# Altium project OpenRex_V1I1.PrjPcb (part 1 of 13)
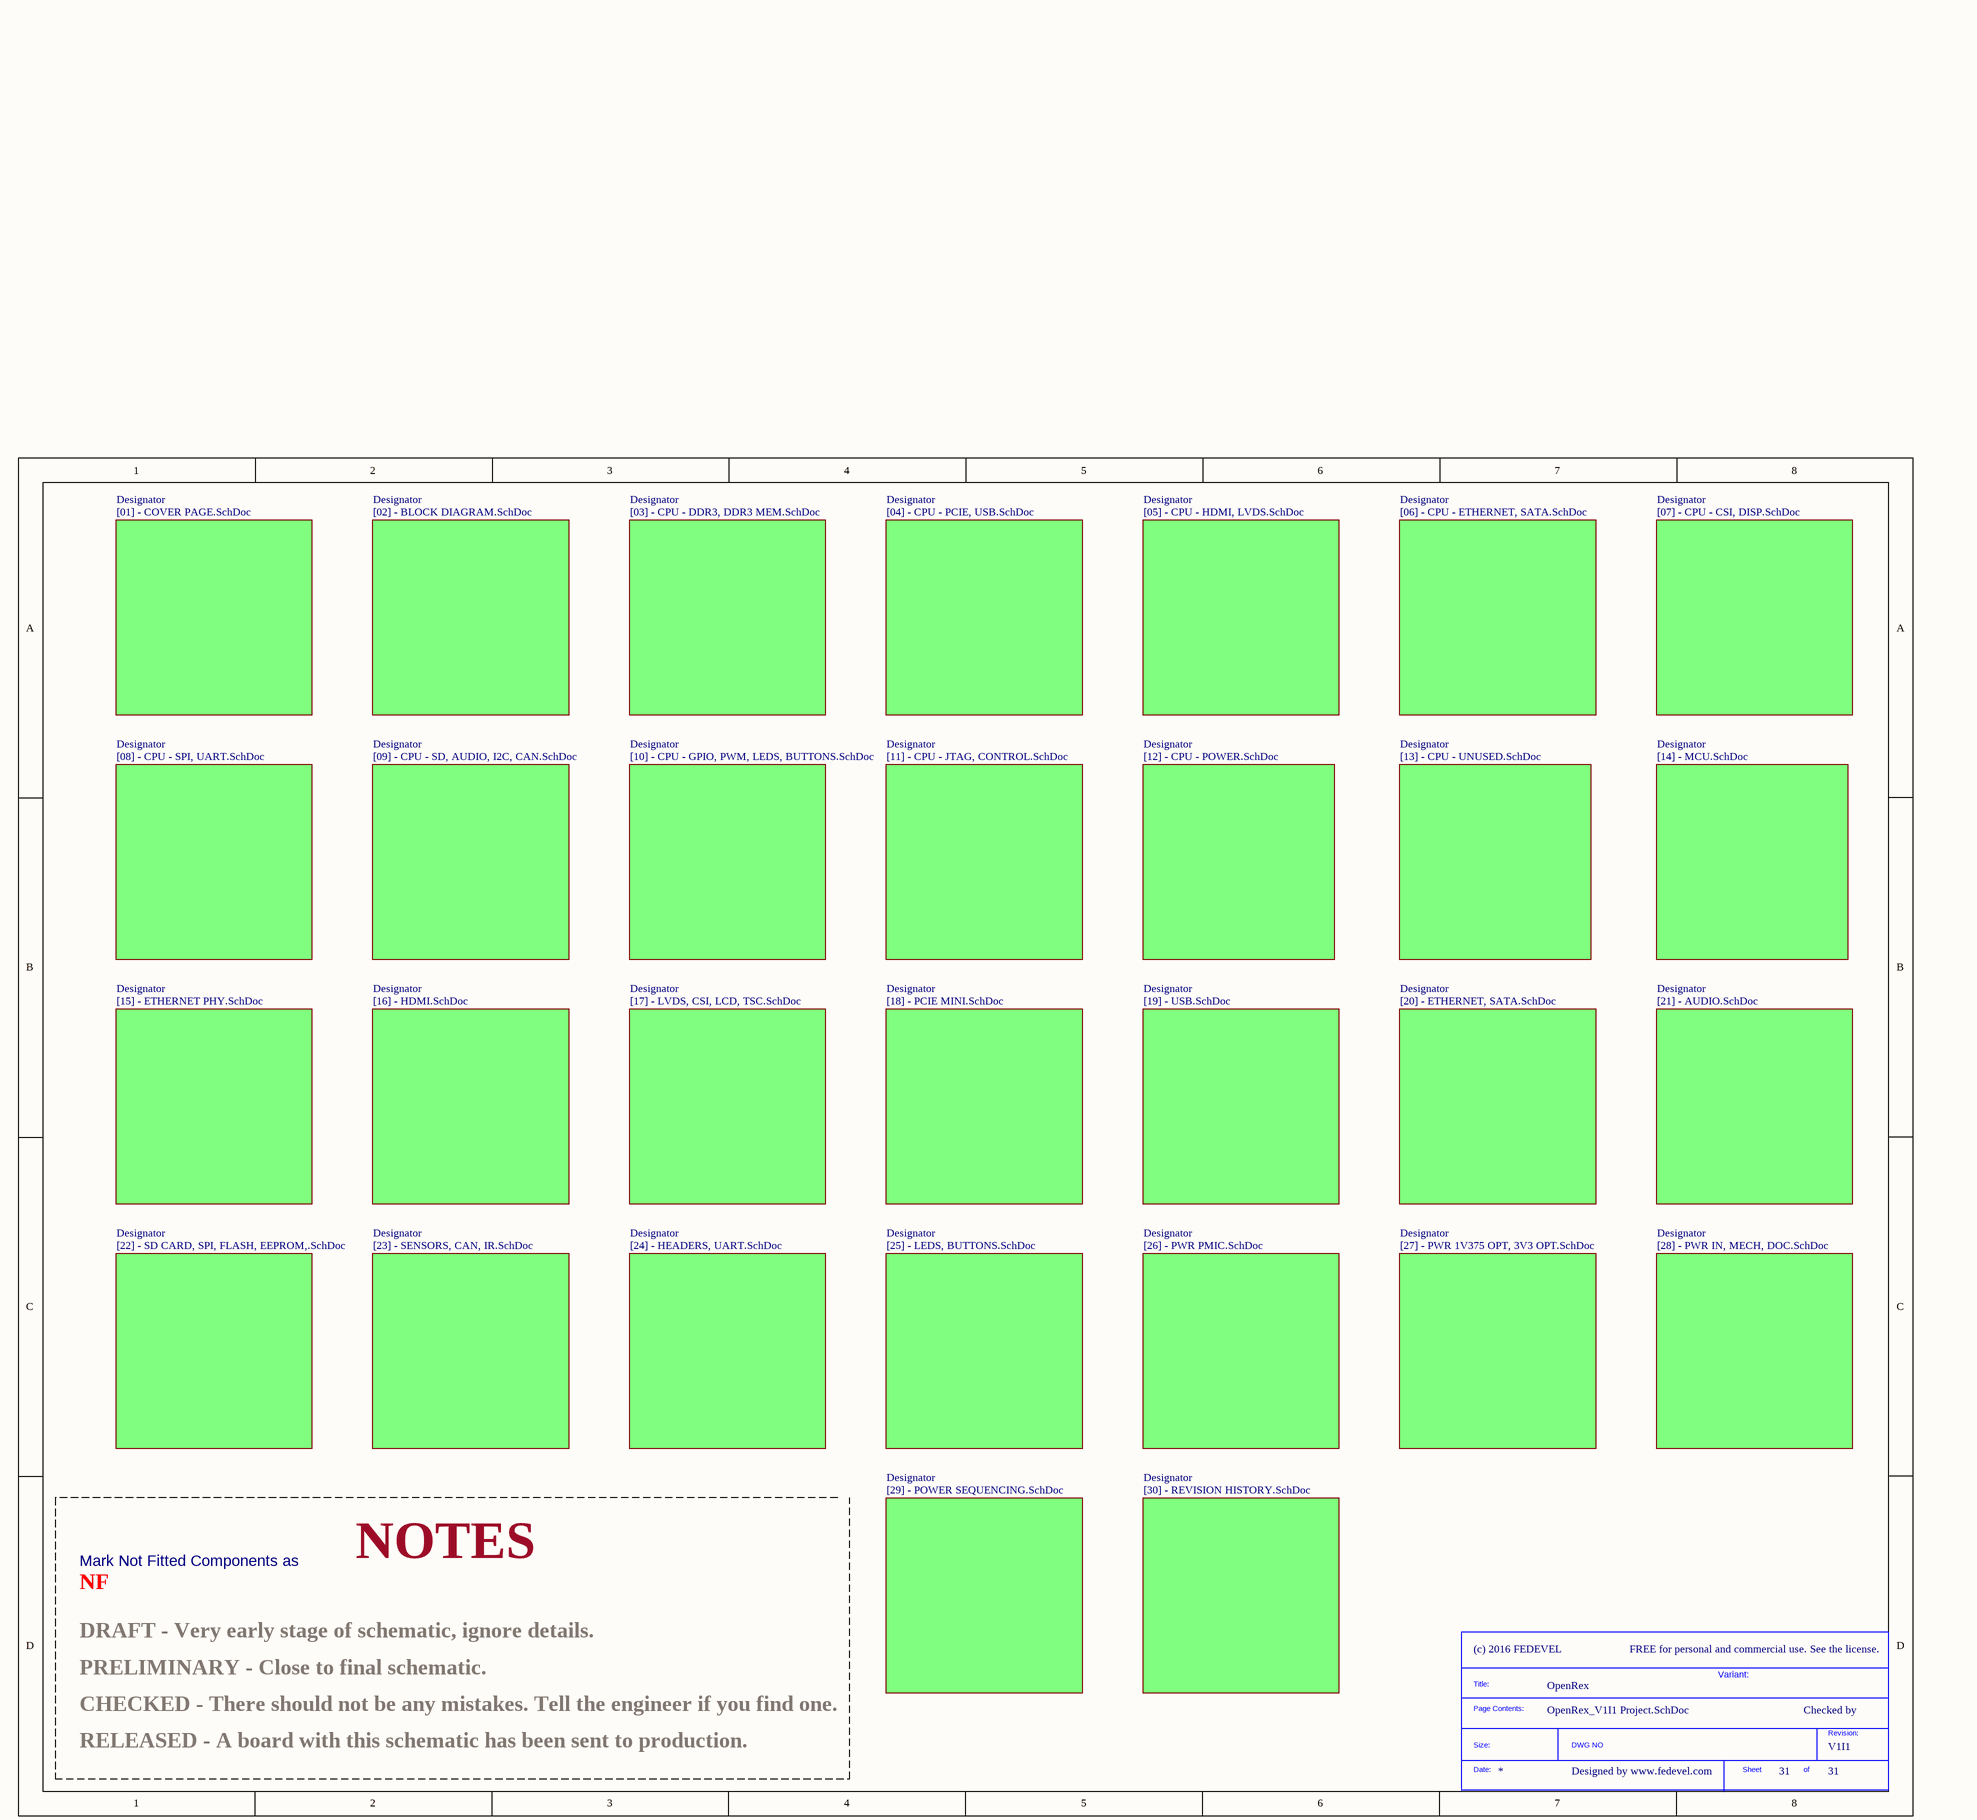
[diagram p0: OpenRex_V1I1 Project.SchDoc]
VersionRevision: V1I1; Project: OpenRex; NotFitted: NF; Company: (c) 2016 FEDEVEL; ClientWebsite: www.fedevel.com; ClientContactName: Robert Feranec; ClientContactEmail: robert.feranec@fedevel.com; ClientCompanyName: FEDEVEL Academy
30 sheets, 985 parts. Net scope: flat (ports and power ports of the same name join across sheets).
Board file: OpenRex_V1I1_PCB.PcbDoc
Sheets:
  OpenRex_V1I1 Project.SchDoc
    Designator = [01] - COVER PAGE.SchDoc
    Designator = [02] - BLOCK DIAGRAM.SchDoc
    Designator = [17] - LVDS, CSI, LCD, TSC.SchDoc
    Designator = [04] - CPU - PCIE, USB.SchDoc
    Designator = [05] - CPU - HDMI, LVDS.SchDoc
    Designator = [06] - CPU - ETHERNET, SATA.SchDoc
    Designator = [08] - CPU - SPI, UART.SchDoc
    Designator = [10] - CPU - GPIO, PWM, LEDS, BUTTONS.SchDoc
    Designator = [09] - CPU - SD, AUDIO, I2C, CAN.SchDoc
    Designator = [11] - CPU - JTAG, CONTROL.SchDoc
    Designator = [12] - CPU - POWER.SchDoc
    Designator = [18] - PCIE MINI.SchDoc
    Designator = [13] - CPU - UNUSED.SchDoc
    Designator = [15] - ETHERNET PHY.SchDoc
    Designator = [19] - USB.SchDoc
    Designator = [07] - CPU - CSI, DISP.SchDoc
    Designator = [14] - MCU.SchDoc
    Designator = [20] - ETHERNET, SATA.SchDoc
    Designator = [25] - LEDS, BUTTONS.SchDoc
    Designator = [26] - PWR PMIC.SchDoc
    Designator = [27] - PWR 1V375 OPT, 3V3 OPT.SchDoc
    Designator = [28] - PWR IN, MECH, DOC.SchDoc
    Designator = [22] - SD CARD, SPI, FLASH, EEPROM,.SchDoc
    Designator = [23] - SENSORS, CAN, IR.SchDoc
    Designator = [30] - REVISION HISTORY.SchDoc
    Designator = [16] - HDMI.SchDoc
    Designator = [21] - AUDIO.SchDoc
    Designator = [24] - HEADERS, UART.SchDoc
    Designator = [29] - POWER SEQUENCING.SchDoc

## Sheet OpenRex_V1I1 Project.SchDoc
size A3; DocumentNumber: 31; SheetNumber: 31; SheetTotal: 31; PageSetup: Record=PageOptions|CenterHorizontal=True|CenterVertical=True|PrintScale=1.07|XCorrection=1.00|YCorrection=1.00|PrintKind=1|BorderSize=5000000|LeftOffset=0|BottomOffset=0|Orientation=2|PaperLength=1000|PaperWidth=1000|Scale=100|PaperSource=7|PrintQuality=600|MediaType=1|DitherType=10|PaperKind=A3|PrintScaleMode=1

### Parts
(Parts that share a designator on the sheet are numbered #1, #2 ... from top to bottom, then left to right.)
*#1  SDTitleBlock  (value not drawn)  (graphical)

### Sub-sheets
Designator = [01] - COVER PAGE.SchDoc: no entries
Designator = [02] - BLOCK DIAGRAM.SchDoc: no entries
Designator = [17] - LVDS, CSI, LCD, TSC.SchDoc: no entries
Designator = [04] - CPU - PCIE, USB.SchDoc: no entries
Designator = [05] - CPU - HDMI, LVDS.SchDoc: no entries
Designator = [06] - CPU - ETHERNET, SATA.SchDoc: no entries
Designator = [08] - CPU - SPI, UART.SchDoc: no entries
Designator = [10] - CPU - GPIO, PWM, LEDS, BUTTONS.SchDoc: no entries
Designator = [09] - CPU - SD, AUDIO, I2C, CAN.SchDoc: no entries
Designator = [03] - CPU - DDR3, DDR3 MEM.SchDoc (file not in this document): no entries
Designator = [11] - CPU - JTAG, CONTROL.SchDoc: no entries
Designator = [12] - CPU - POWER.SchDoc: no entries
Designator = [18] - PCIE MINI.SchDoc: no entries
Designator = [13] - CPU - UNUSED.SchDoc: no entries
Designator = [15] - ETHERNET PHY.SchDoc: no entries
Designator = [19] - USB.SchDoc: no entries
Designator = [07] - CPU - CSI, DISP.SchDoc: no entries
Designator = [14] - MCU.SchDoc: no entries
Designator = [20] - ETHERNET, SATA.SchDoc: no entries
Designator = [25] - LEDS, BUTTONS.SchDoc: no entries
Designator = [26] - PWR PMIC.SchDoc: no entries
Designator = [27] - PWR 1V375 OPT, 3V3 OPT.SchDoc: no entries
Designator = [28] - PWR IN, MECH, DOC.SchDoc: no entries
Designator = [22] - SD CARD, SPI, FLASH, EEPROM,.SchDoc: no entries
Designator = [23] - SENSORS, CAN, IR.SchDoc: no entries
Designator = [30] - REVISION HISTORY.SchDoc: no entries
Designator = [16] - HDMI.SchDoc: no entries
Designator = [21] - AUDIO.SchDoc: no entries
Designator = [24] - HEADERS, UART.SchDoc: no entries
Designator = [29] - POWER SEQUENCING.SchDoc: no entries

### Notes on the sheet
- NF
- Mark Not Fitted Components as
- NOTES
- DRAFT - Very early stage of schematic, ignore details.
- FREE for personal and commercial use. See the license.
- PRELIMINARY - Close to final schematic.
- CHECKED - There should not be any mistakes. Tell the engineer if you find one.
- Variant:
- Checked by
- RELEASED - A board with this schematic has been sent to production.
- Designed by www.fedevel.com
- (in symbol SDTitleBlock) Title:; Page Contents:; Revision:; Size:; DWG NO; Date:; Sheet; of

## Sheet [01] - COVER PAGE.SchDoc
size A3; DocumentNumber: 1; SheetNumber: 1; SheetTotal: 31
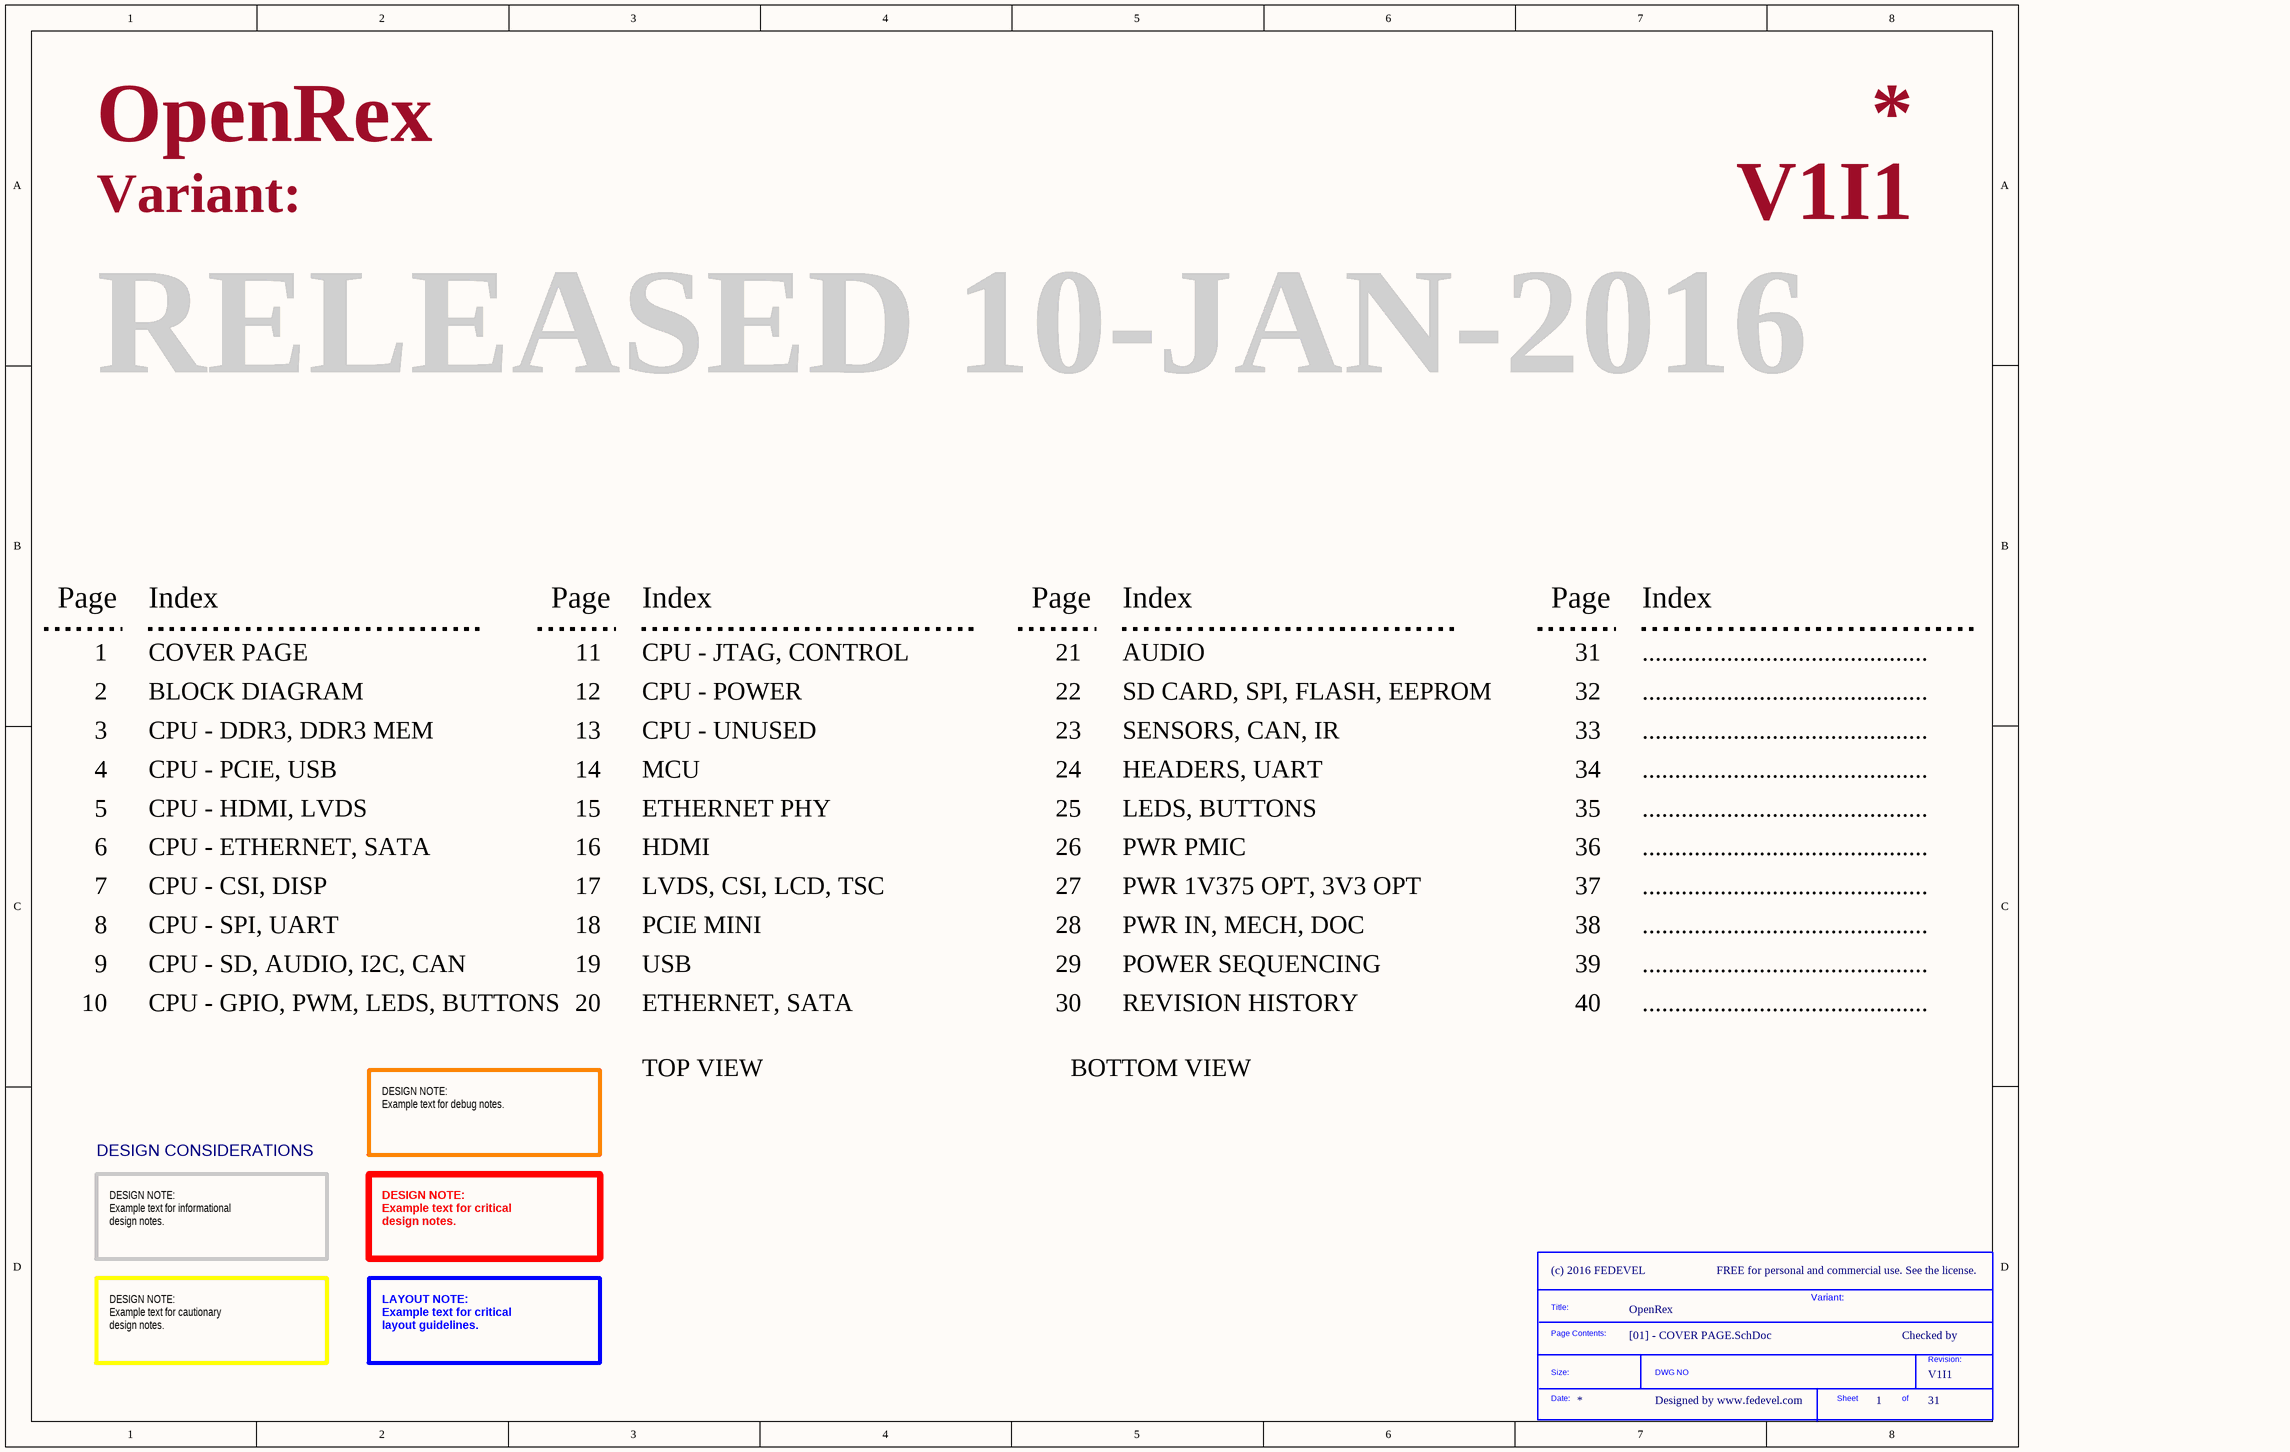
[diagram p1: [01] - COVER PAGE.SchDoc]

### Parts
(Parts that share a designator on the sheet are numbered #1, #2 ... from top to bottom, then left to right.)
*#2  SDTitleBlock  (value not drawn)  (graphical)

### Notes on the sheet
- Variant:
- RELEASED 10-JAN-2016
- Page
- Index
- 1
- COVER PAGE
- 11
- CPU - JTAG, CONTROL
- 21
- AUDIO
- 31
- ............................................
- 2
- 3
- BLOCK DIAGRAM
- CPU - DDR3, DDR3 MEM
- 12
- 13
- CPU - POWER
- CPU - UNUSED
- 22
- 23
- SD CARD, SPI, FLASH, EEPROM
- SENSORS, CAN, IR
- 32
- 33
- 4
- 5
- CPU - PCIE, USB
- CPU - HDMI, LVDS
- 14
- 15
- MCU
- ETHERNET PHY
- 24
- 25
- HEADERS, UART
- LEDS, BUTTONS
- 34
- 35
- 6
- CPU - ETHERNET, SATA
- 16
- HDMI
- 26
- PWR PMIC
- 36
- 7
- 8
- CPU - SPI, UART
- CPU - CSI, DISP
- 17
- 18
- LVDS, CSI, LCD, TSC
- PCIE MINI
- 27
- 28
- PWR 1V375 OPT, 3V3 OPT
- PWR IN, MECH, DOC
- 37
- 38
- 9
- 10
- CPU - SD, AUDIO, I2C, CAN
- CPU - GPIO, PWM, LEDS, BUTTONS
- 19
- 20
- USB
- ETHERNET, SATA
- 29
- 30
- POWER SEQUENCING
- REVISION HISTORY
- 39
- 40
- TOP VIEW
- BOTTOM VIEW
- DESIGN NOTE:
  Example text for debug notes.
- DESIGN CONSIDERATIONS
- DESIGN NOTE:
  Example text for informational
  design notes.
- DESIGN NOTE:
  Example text for critical
  design notes.
- FREE for personal and commercial use. See the license.
- Checked by
- DESIGN NOTE:
  Example text for cautionary
  design notes.
- LAYOUT NOTE:
  Example text for critical
  layout guidelines.
- Designed by www.fedevel.com
- (in symbol SDTitleBlock) Title:; Page Contents:; Revision:; Size:; DWG NO; Date:; Sheet; of

## Sheet [02] - BLOCK DIAGRAM.SchDoc
size A2; DocumentNumber: 2; SheetNumber: 2; SheetTotal: 31; PageSetup: Record=PageOptions|CenterHorizontal=True|CenterVertical=True|PrintScale=0.52|XCorrection=1.00|YCorrection=1.00|PrintKind=1|BorderSize=5000000|LeftOffset=0|BottomOffset=0|Orientation=2|PaperLength=1000|PaperWidth=1000|Scale=100|PaperSource=4|PrintQuality=600|MediaType=1|DitherType=10|PrintScaleMode=1|PaperKind=A4|PaperIndex=9
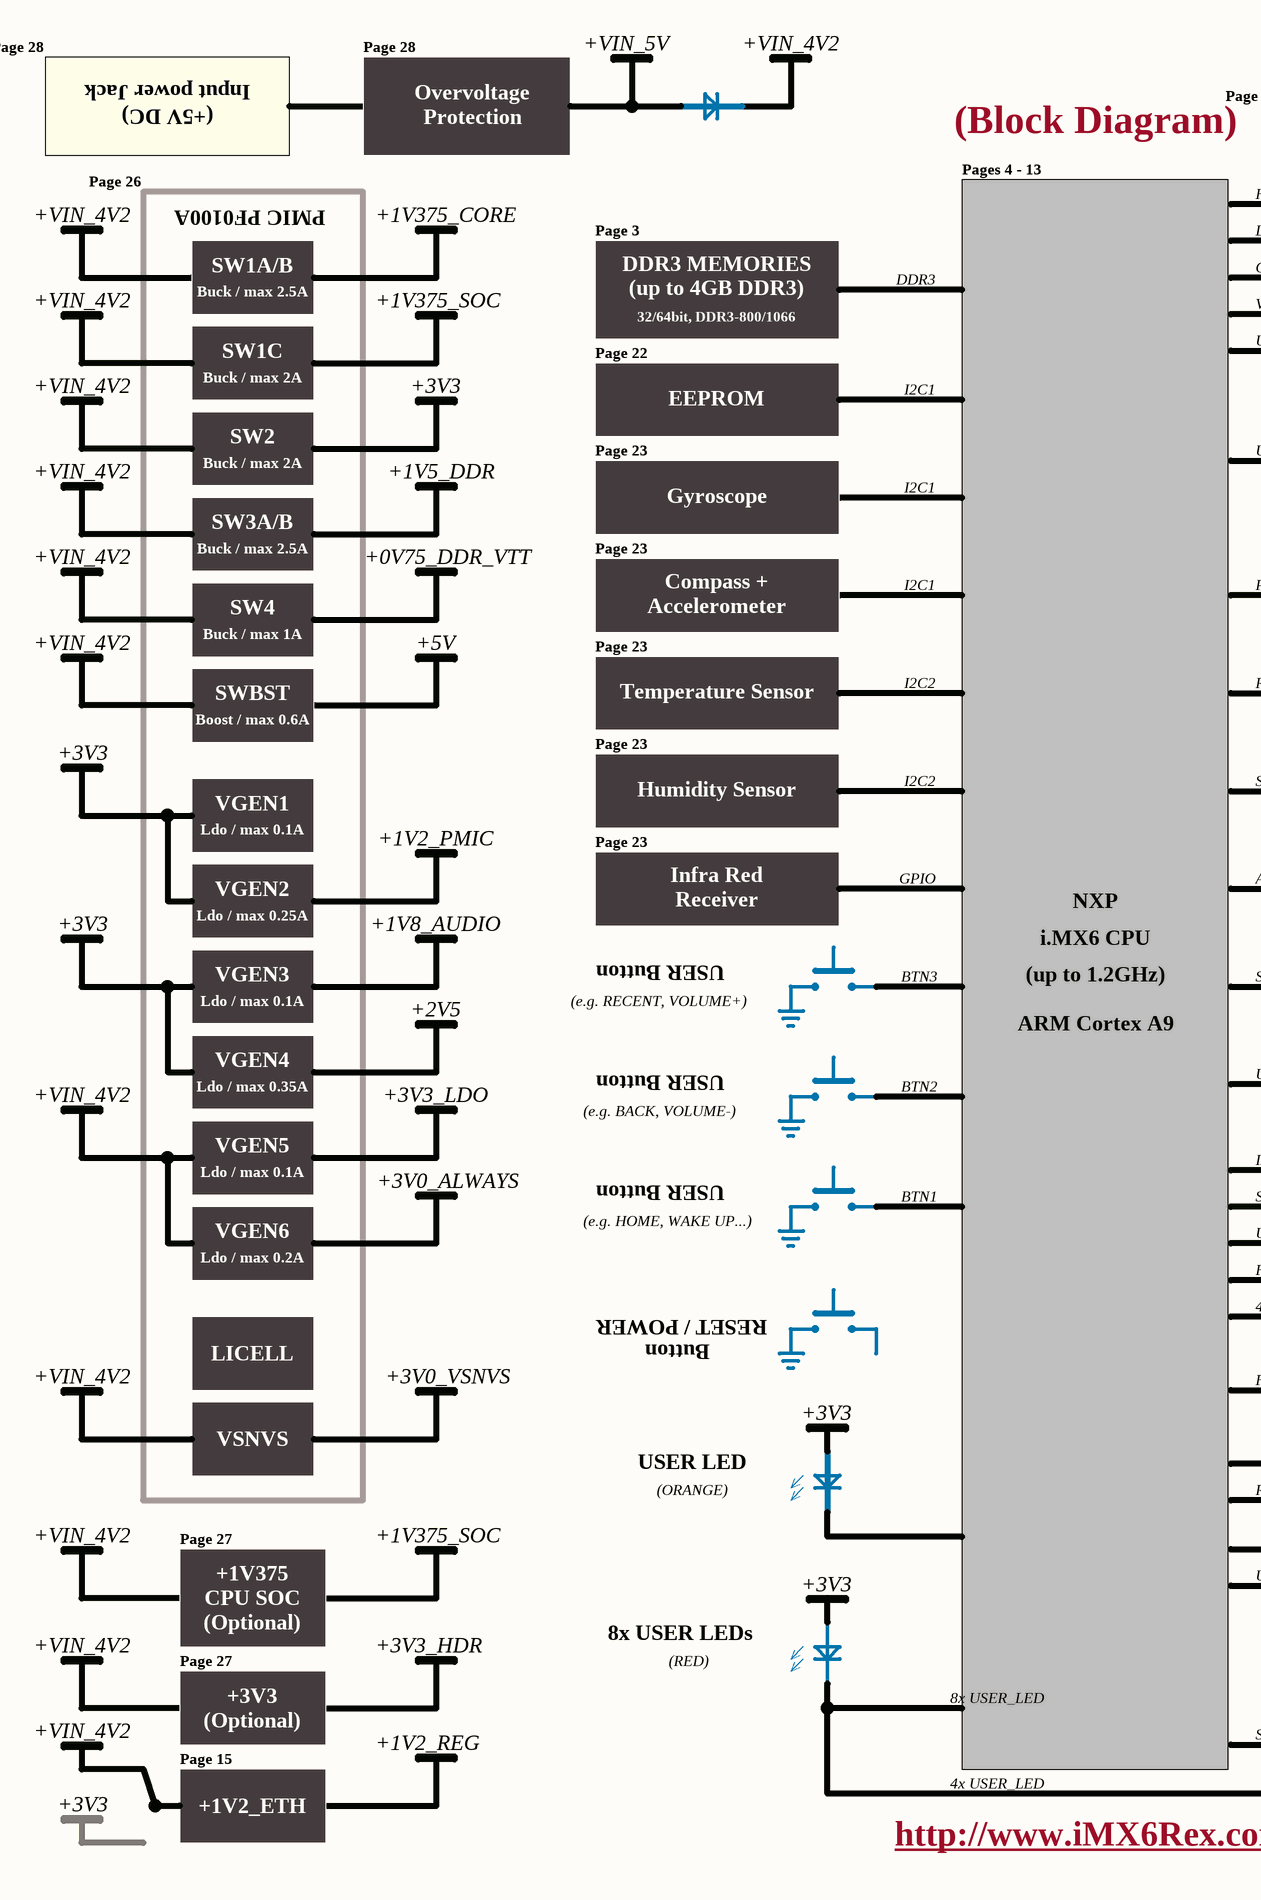
[diagram p2: [02] - BLOCK DIAGRAM.SchDoc, left]
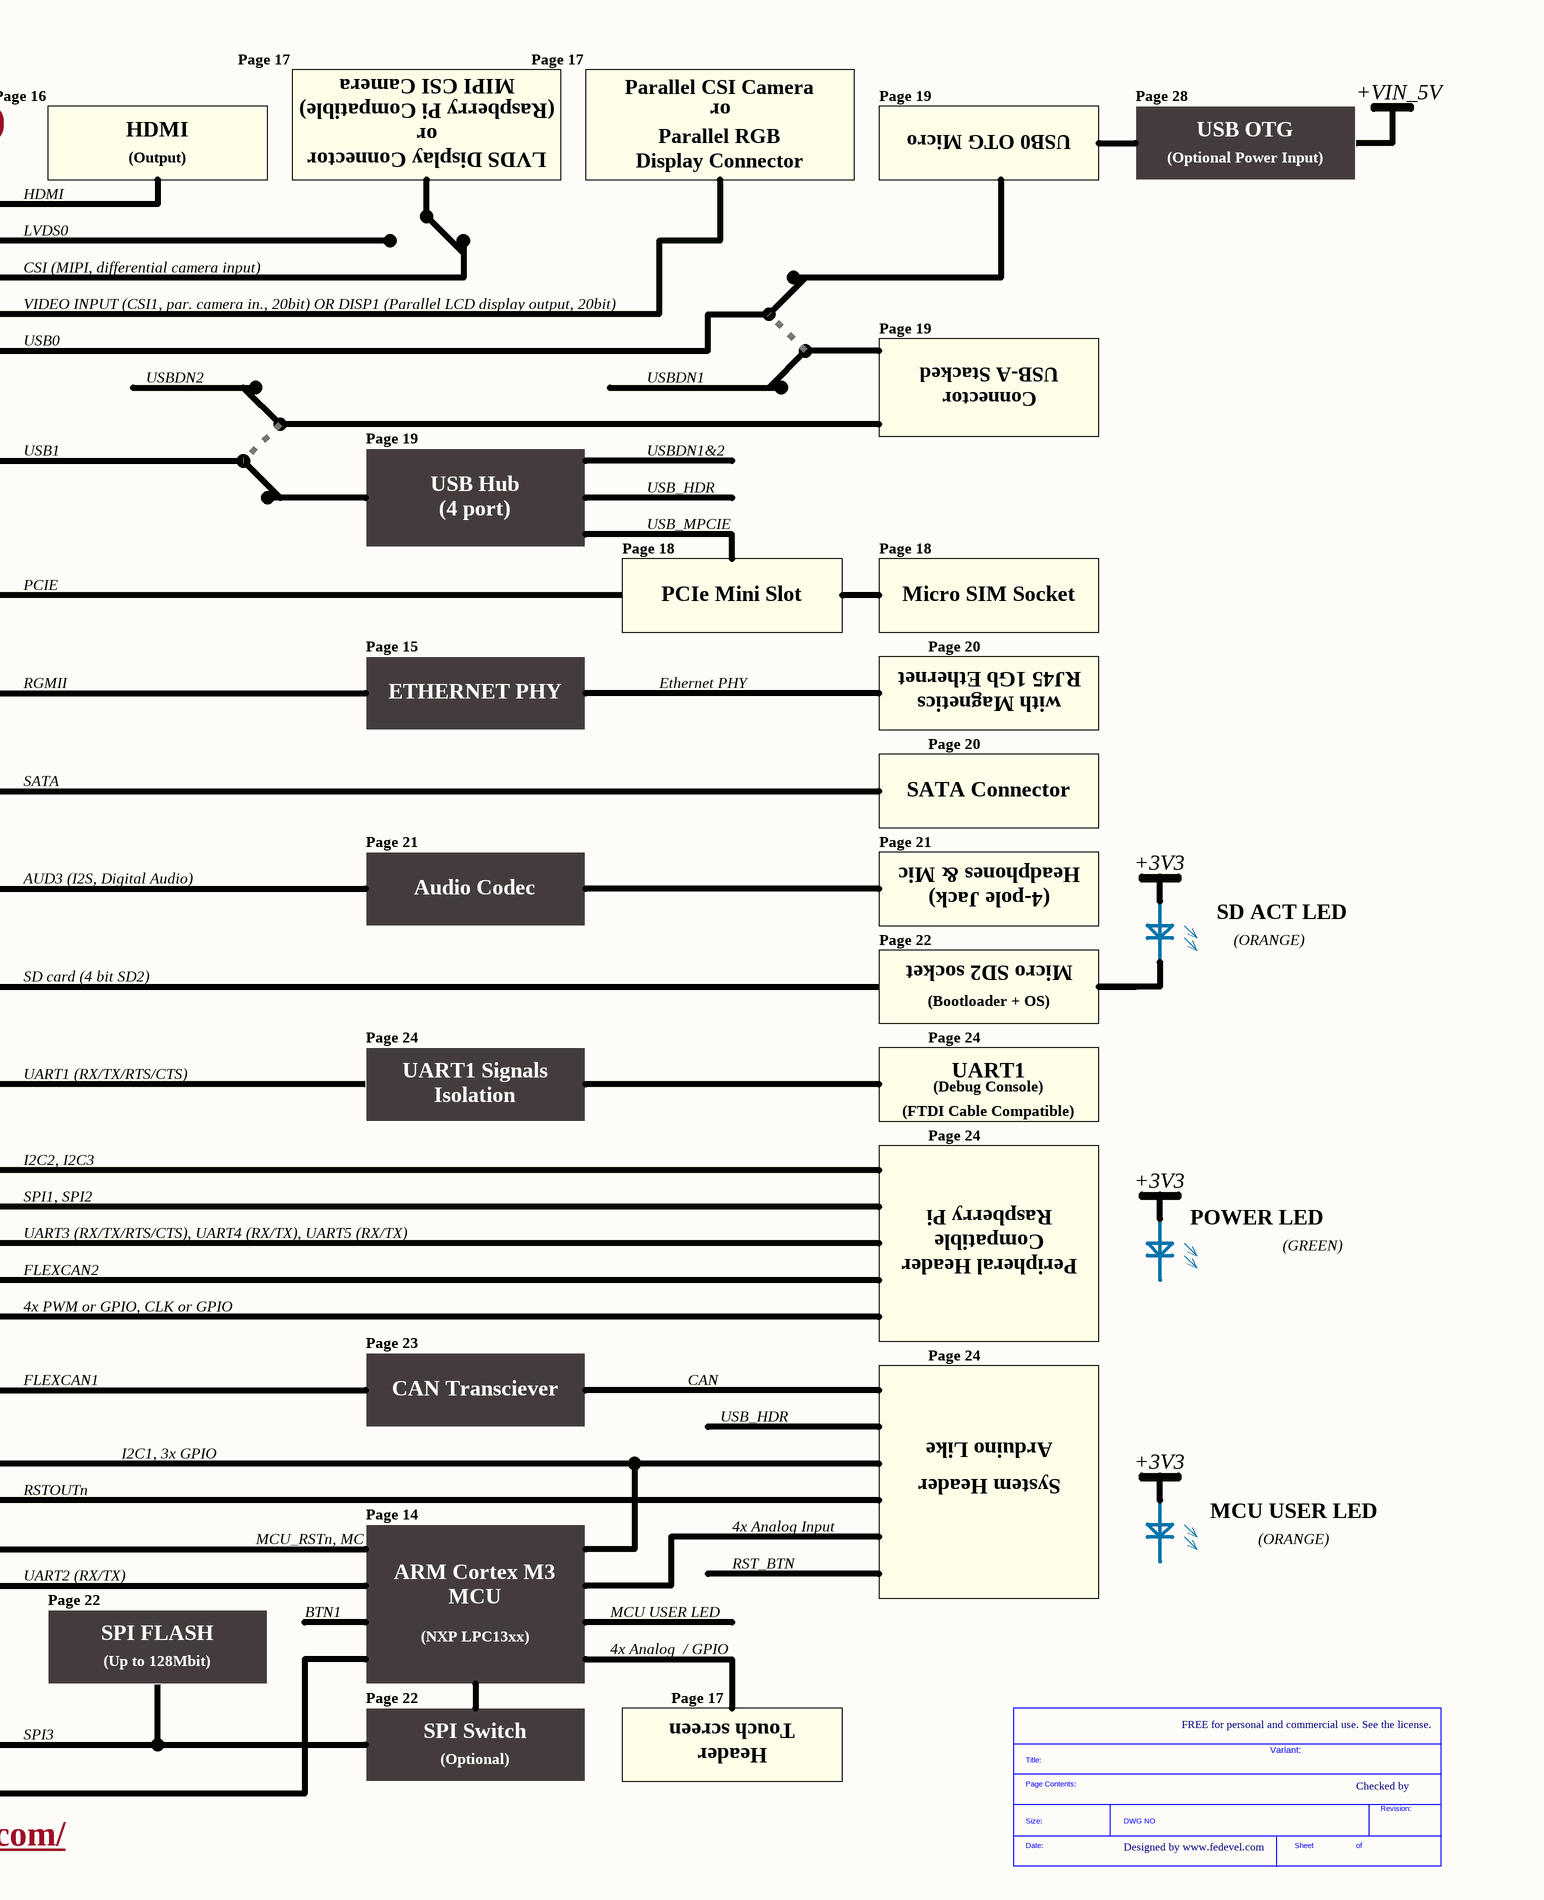
[diagram p3: [02] - BLOCK DIAGRAM.SchDoc, right]

### Parts
(Parts that share a designator on the sheet are numbered #1, #2 ... from top to bottom, then left to right.)
*#3  SDTitleBlock  (value not drawn)  (graphical)

### Notes on the sheet
- Page 28
- +VIN_5V
- +VIN_4V2
- Page 17
- MIPI CSI Camera
- Parallel CSI Camera
- Input power Jack
- (+5V DC)
- Overvoltage
- Protection
- (Block Diagram)
- Page 16
- HDMI
- (Raspberry Pi Compatible)
- or
- Parallel RGB
- Page 19
- USB0 OTG Micro
- USB OTG
- Page 26
- PMIC PF0100A
- Pages 4 - 13
- (Output)
- LVDS Display Connector
- Display Connector
- (Optional Power Input)
- SW1A/B
- +1V375_CORE
- Page 3
- DDR3 MEMORIES
- LVDS0
- CSI (MIPI, differential camera input)
- Buck / max 2.5A
- +1V375_SOC
- 32/64bit, DDR3-800/1066
- (up to 4GB DDR3)
- DDR3
- VIDEO INPUT (CSI1, par. camera in., 20bit) OR DISP1 (Parallel LCD display output, 20bit)
- SW1C
- Buck / max 2A
- +3V3
- Page 22
- I2C1
- USB0
- USBDN2
- USBDN1
- USB-A Stacked
- SW2
- Page 23
- EEPROM
- USB1
- USBDN1&2
- Connector
- SW3A/B
- +1V5_DDR
- Gyroscope
- USB Hub
- (4 port)
- USB_HDR
- +0V75_DDR_VTT
- Page 18
- USB_MPCIE
- SW4
- Buck / max 1A
- Compass +
- Accelerometer
- PCIE
- PCIe Mini Slot
- Micro SIM Socket
- SWBST
- +5V
- Temperature Sensor
- I2C2
- RGMII
- Page 15
- ETHERNET PHY
- Ethernet PHY
- Page 20
- RJ45 1Gb Ethernet
- Boost / max 0.6A
- with Magnetics
- VGEN1
- Humidity Sensor
- SATA
- SATA Connector
- Ldo / max 0.1A
- VGEN2
- +1V2_PMIC
- Infra Red
- GPIO
- AUD3 (I2S, Digital Audio)
- Page 21
- Headphones & Mic
- Ldo / max 0.25A
- +1V8_AUDIO
- Receiver
- NXP
- i.MX6 CPU
- Audio Codec
- (4-pole Jack)
- (ORANGE)
- SD ACT LED
- VGEN3
- (e.g. RECENT, VOLUME+)
- USER Button
- BTN3
- (up to 1.2GHz)
- SD card (4 bit SD2)
- Micro SD2 socket
- (Bootloader + OS)
- VGEN4
- +2V5
- ARM Cortex A9
- Page 24
- Ldo / max 0.35A
- +3V3_LDO
- (e.g. BACK, VOLUME-)
- BTN2
- UART1 (RX/TX/RTS/CTS)
- UART1 Signals
- Isolation
- UART1
- (Debug Console)
- (FTDI Cable Compatible)
- VGEN5
- +3V0_ALWAYS
- I2C2, I2C3
- VGEN6
- (e.g. HOME, WAKE UP...)
- BTN1
- SPI1, SPI2
- UART3 (RX/TX/RTS/CTS), UART4 (RX/TX), UART5 (RX/TX)
- Raspberry Pi
- Compatible
- POWER LED
- (GREEN)
- Ldo / max 0.2A
- 4x PWM or GPIO, CLK or GPIO
- FLEXCAN2
- Peripheral Header
- LICELL
- RESET / POWER
- Button
- VSNVS
- +3V0_VSNVS
- FLEXCAN1
- CAN Transciever
- CAN
- USER LED
- RSTOUTn
- I2C1, 3x GPIO
- System Header
- Arduino Like
- Page 27
- MCU_RSTn, MCU_ISPn, SWD debug
- Page 14
- 4x Analog Input
- MCU USER LED
- +1V375
- CPU SOC
- (Optional)
- UART2 (RX/TX)
- ARM Cortex M3
- MCU
- RST_BTN
- +3V3_HDR
- (RED)
- 8x USER LEDs
- SPI FLASH
- (Up to 128Mbit)
- (NXP LPC13xx)
- 4x Analog  / GPIO
- 8x USER_LED
- SPI3
- SPI Switch
- Touch screen
- FREE for personal and commercial use. See the license.
- +1V2_ETH
- +1V2_REG
- 4x USER_LED
- Header
- Variant:
- Checked by
- http://www.iMX6Rex.com/
- Designed by www.fedevel.com
- (in symbol SDTitleBlock) Title:; Page Contents:; Revision:; Size:; DWG NO; Date:; Sheet; of

## Sheet [17] - LVDS, CSI, LCD, TSC.SchDoc
size A2; DocumentNumber: 17; SheetNumber: 17; SheetTotal: 31
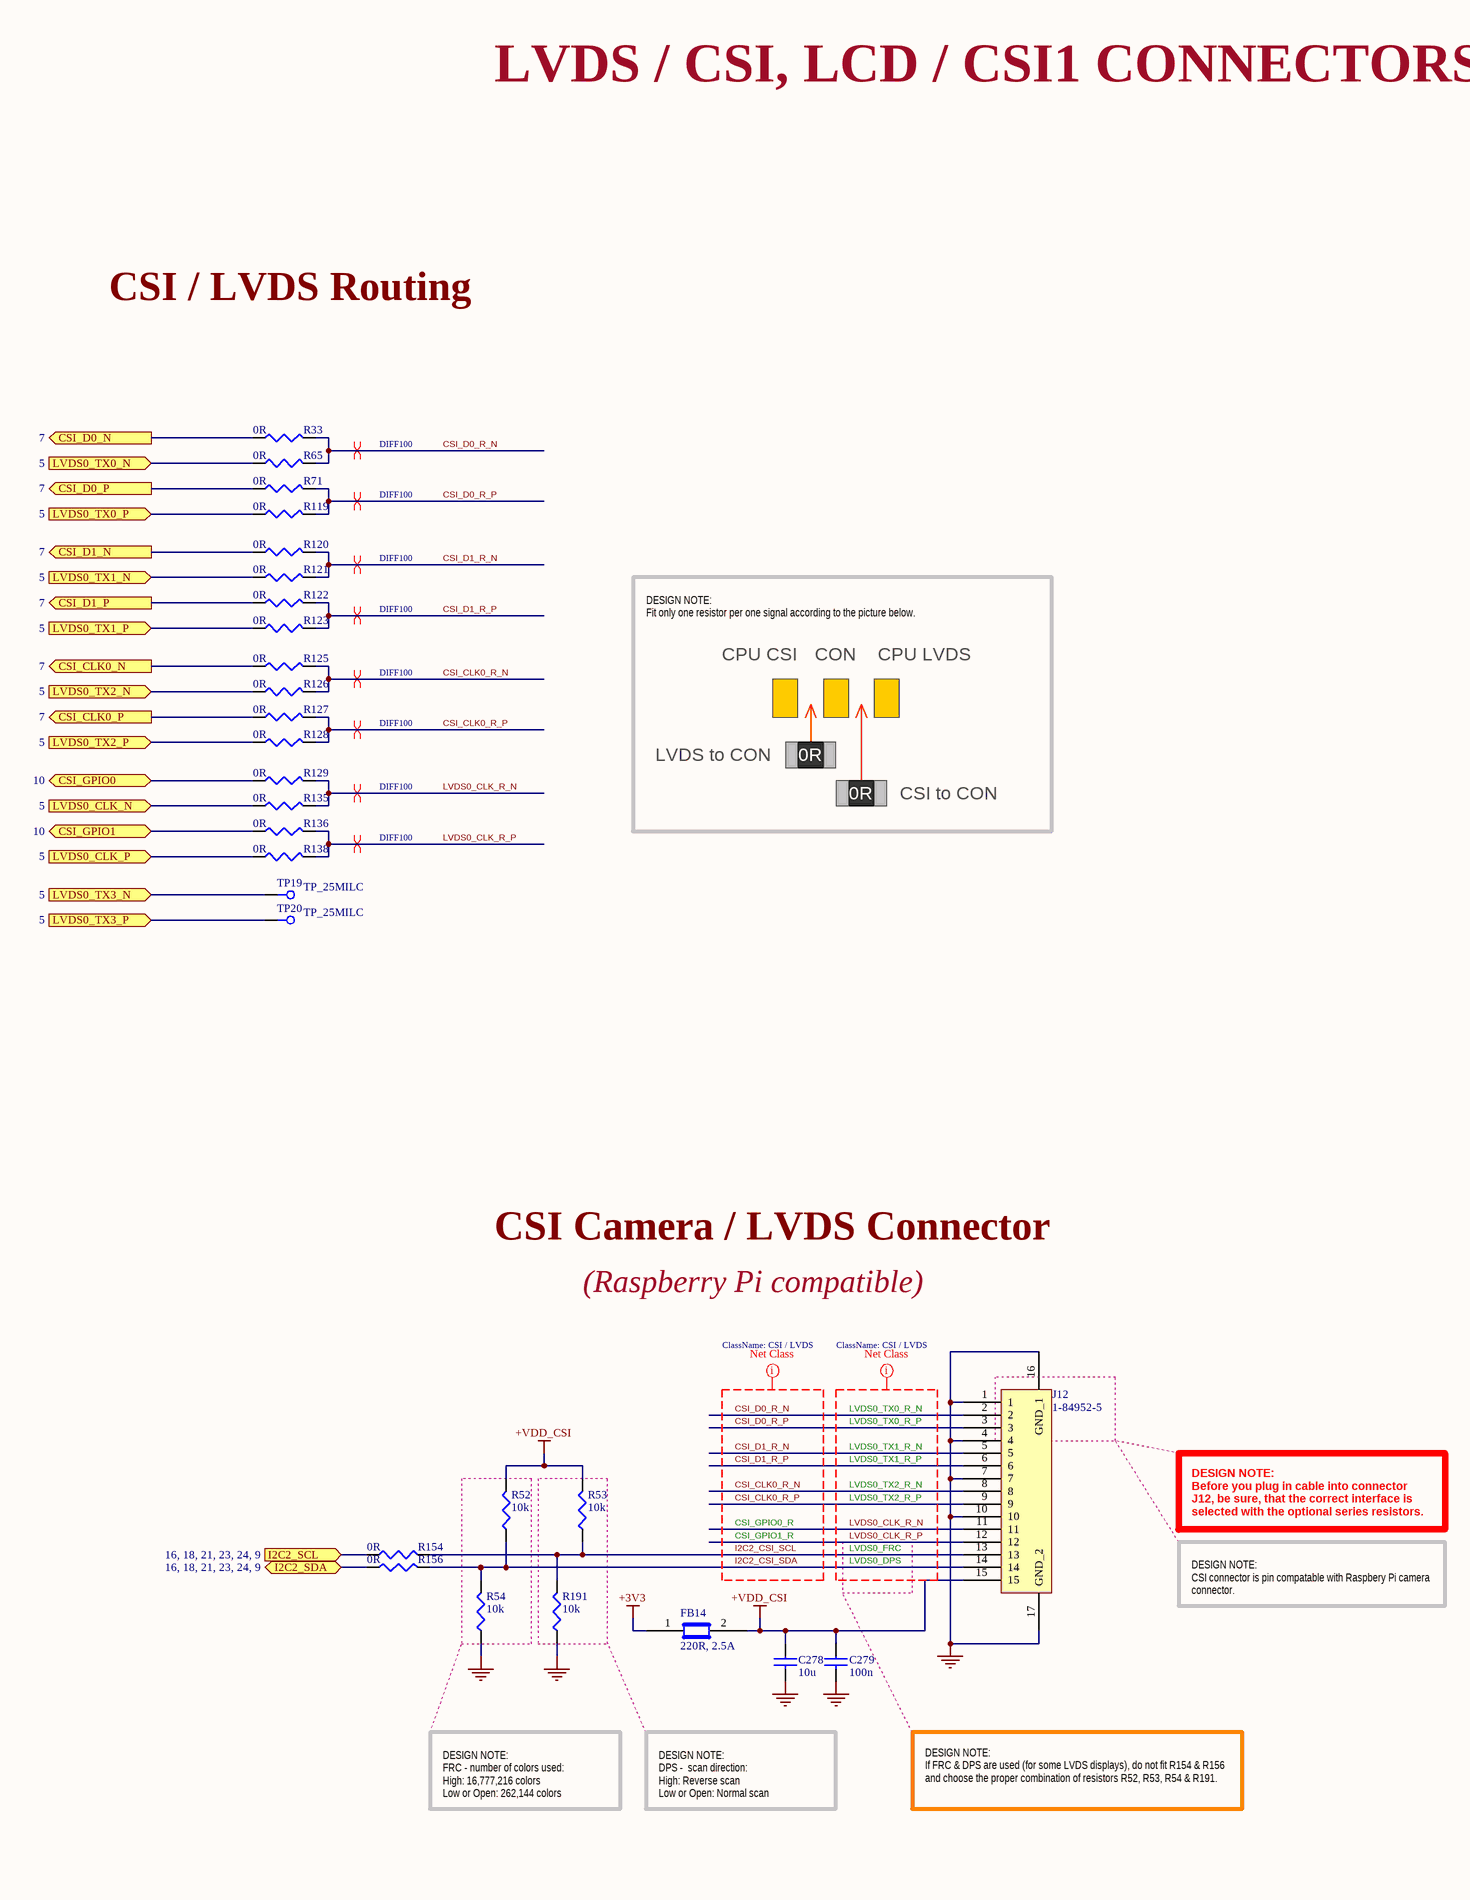
[diagram p4: [17] - LVDS, CSI, LCD, TSC.SchDoc, left]
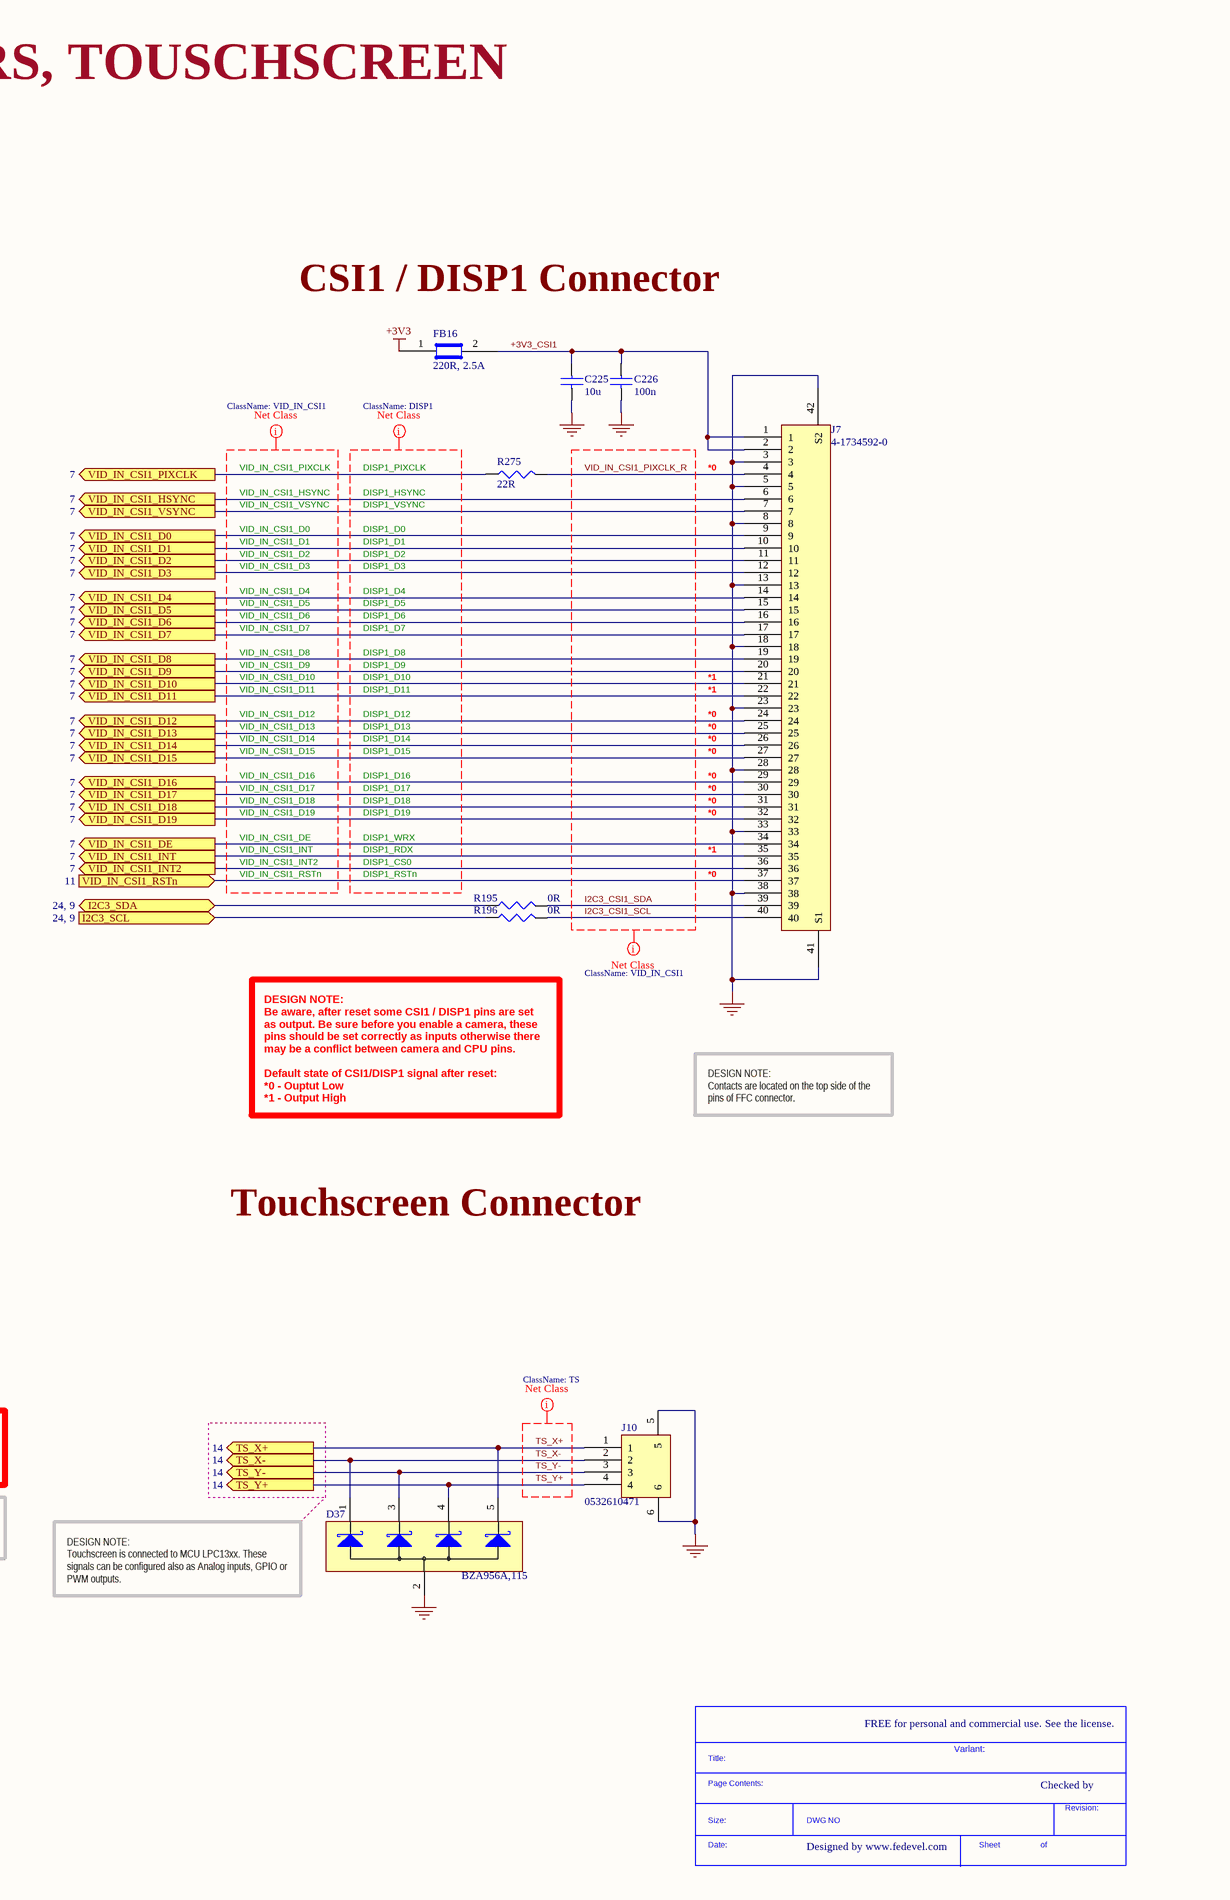
[diagram p5: [17] - LVDS, CSI, LCD, TSC.SchDoc, right]

### Parts
(Parts that share a designator on the sheet are numbered #1, #2 ... from top to bottom, then left to right.)
*#4  SDTitleBlock  (value not drawn)  (graphical)
C225  10u  [C0603]
C226  100n  [C0402]
C278  10u  [C0603]
C279  100n  [C0402]
D37  BZA956A,115  [SOT665]
FB14  220R, 2.5A  [C0603]
FB16  220R, 2.5A  [C0603]
J7  4-1734592-0  [4-1734592-0]
J10  0532610471  [0532610471]
J12  1-84952-5  [ZIF_RA_BOTTOM_15x1mm]
R33  0R  [R0402]
R52  10k  [R0402]
R53  10k  [R0402]
R54  10k  [R0402]
R65  0R  [R0402]
R71  0R  [R0402]
R119  0R  [R0402]
R120  0R  [R0402]
R121  0R  [R0402]
R122  0R  [R0402]
R123  0R  [R0402]
R125  0R  [R0402]
R126  0R  [R0402]
R127  0R  [R0402]
R128  0R  [R0402]
R129  0R  [R0402]
R135  0R  [R0402]
R136  0R  [R0402]
R138  0R  [R0402]
R154  0R  [R0402]
R156  0R  [R0402]
R191  10k  [R0402]
R195  0R  [R0402]
R196  0R  [R0402]
R275  22R  [R0402]
TP19  TP_25MILC  [TP_25C]  (no BOM)
TP20  TP_25MILC  [TP_25C]  (no BOM)

### Ports
CSI_CLK0_N (out, see 7), CSI_CLK0_P (out, see 7), CSI_D0_N (out, see 7), CSI_D0_P (out, see 7), CSI_D1_N (out, see 7), CSI_D1_P (out, see 7), CSI_GPIO0 (bidir, see 10), CSI_GPIO1 (bidir, see 10), I2C2_SCL (see 16, 18, 21, 23, 24, 9), I2C2_SDA (bidir, see 16, 18, 21, 23, 24, 9), I2C3_SCL (see 24, 9), I2C3_SDA (bidir, see 24, 9), LVDS0_CLK_N (in, see 5), LVDS0_CLK_P (in, see 5), LVDS0_TX0_N (in, see 5), LVDS0_TX0_P (in, see 5), LVDS0_TX1_N (in, see 5), LVDS0_TX1_P (in, see 5), LVDS0_TX2_N (in, see 5), LVDS0_TX2_P (in, see 5), LVDS0_TX3_N (in, see 5), LVDS0_TX3_P (in, see 5), TS_X+ (out, see 14), TS_X- (out, see 14), TS_Y+ (out, see 14), TS_Y- (out, see 14), VID_IN_CSI1_D0 (out, see 7), VID_IN_CSI1_D1 (out, see 7), VID_IN_CSI1_D2 (out, see 7), VID_IN_CSI1_D3 (out, see 7), VID_IN_CSI1_D4 (out, see 7), VID_IN_CSI1_D5 (out, see 7), VID_IN_CSI1_D6 (out, see 7), VID_IN_CSI1_D7 (out, see 7), VID_IN_CSI1_D8 (out, see 7), VID_IN_CSI1_D9 (out, see 7), VID_IN_CSI1_D10 (out, see 7), VID_IN_CSI1_D11 (out, see 7), VID_IN_CSI1_D12 (out, see 7), VID_IN_CSI1_D13 (out, see 7), VID_IN_CSI1_D14 (out, see 7), VID_IN_CSI1_D15 (out, see 7), VID_IN_CSI1_D16 (out, see 7), VID_IN_CSI1_D17 (out, see 7), VID_IN_CSI1_D18 (out, see 7), VID_IN_CSI1_D19 (out, see 7), VID_IN_CSI1_DE (out, see 7), VID_IN_CSI1_HSYNC (out, see 7), VID_IN_CSI1_INT2 (out, see 7), VID_IN_CSI1_INT (out, see 7), VID_IN_CSI1_PIXCLK (out, see 7), VID_IN_CSI1_RSTn (in, see 11), VID_IN_CSI1_VSYNC (out, see 7)

### Nets
+3V3: FB14.1 FB16.1
+VDD_CSI: C278.1 C279.1 FB14.2 J12.15 R52.2 R53.2
GND: C225.2 C226.2 C278.2 C279.2 D37.2 J7.3 J7.5 J7.8 J7.13 J7.18 J7.23 J7.28 J7.33 J7.38 J7.41(S1) J7.42(S2) J10.5 J10.6 J12.1 J12.4 J12.7 J12.10 J12.16(GND_1) J12.17(GND_2) R54.1 R191.1
+3V3_CSI1: C225.1 C226.1 FB16.2 J7.1 J7.2
CSI_CLK0_N: R125.1 ; port CSI_CLK0_N
CSI_CLK0_P: R127.1 ; port CSI_CLK0_P
CSI_CLK0_R_N: J12.8 R125.2 R126.2
CSI_CLK0_R_P: J12.9 R127.2 R128.2
CSI_D0_N: R33.1 ; port CSI_D0_N
CSI_D0_P: R71.1 ; port CSI_D0_P
CSI_D0_R_N: J12.2 R33.2 R65.2
CSI_D0_R_P: J12.3 R71.2 R119.2
CSI_D1_N: R120.1 ; port CSI_D1_N
CSI_D1_P: R122.1 ; port CSI_D1_P
CSI_D1_R_N: J12.5 R120.2 R121.2
CSI_D1_R_P: J12.6 R122.2 R123.2
CSI_GPIO0: R129.1 ; port CSI_GPIO0
CSI_GPIO1: R136.1 ; port CSI_GPIO1
I2C2_CSI_SCL: J12.13 R53.1 R154.2 R191.2
I2C2_CSI_SDA: J12.14 R52.1 R54.2 R156.2
I2C2_SCL: R154.1 ; port I2C2_SCL
I2C2_SDA: R156.1 ; port I2C2_SDA
I2C3_CSI1_SCL: J7.40 R196.1
I2C3_CSI1_SDA: J7.39 R195.1
I2C3_SCL: R196.2 ; port I2C3_SCL
I2C3_SDA: R195.2 ; port I2C3_SDA
LVDS0_CLK_N: R135.1 ; port LVDS0_CLK_N
LVDS0_CLK_P: R138.1 ; port LVDS0_CLK_P
LVDS0_CLK_R_N: J12.11 R129.2 R135.2
LVDS0_CLK_R_P: J12.12 R136.2 R138.2
LVDS0_TX0_N: R65.1 ; port LVDS0_TX0_N
LVDS0_TX0_P: R119.1 ; port LVDS0_TX0_P
LVDS0_TX1_N: R121.1 ; port LVDS0_TX1_N
LVDS0_TX1_P: R123.1 ; port LVDS0_TX1_P
LVDS0_TX2_N: R126.1 ; port LVDS0_TX2_N
LVDS0_TX2_P: R128.1 ; port LVDS0_TX2_P
LVDS0_TX3_N: TP19.1 ; port LVDS0_TX3_N
LVDS0_TX3_P: TP20.1 ; port LVDS0_TX3_P
TS_X+: D37.5 J10.1 ; port TS_X+
TS_X-: D37.1 J10.2 ; port TS_X-
TS_Y+: D37.4 J10.4 ; port TS_Y+
TS_Y-: D37.3 J10.3 ; port TS_Y-
VID_IN_CSI1_D0: J7.9 ; port VID_IN_CSI1_D0
VID_IN_CSI1_D1: J7.10 ; port VID_IN_CSI1_D1
VID_IN_CSI1_D2: J7.11 ; port VID_IN_CSI1_D2
VID_IN_CSI1_D3: J7.12 ; port VID_IN_CSI1_D3
VID_IN_CSI1_D4: J7.14 ; port VID_IN_CSI1_D4
VID_IN_CSI1_D5: J7.15 ; port VID_IN_CSI1_D5
VID_IN_CSI1_D6: J7.16 ; port VID_IN_CSI1_D6
VID_IN_CSI1_D7: J7.17 ; port VID_IN_CSI1_D7
VID_IN_CSI1_D8: J7.19 ; port VID_IN_CSI1_D8
VID_IN_CSI1_D9: J7.20 ; port VID_IN_CSI1_D9
VID_IN_CSI1_D10: J7.21 ; port VID_IN_CSI1_D10
VID_IN_CSI1_D11: J7.22 ; port VID_IN_CSI1_D11
VID_IN_CSI1_D12: J7.24 ; port VID_IN_CSI1_D12
VID_IN_CSI1_D13: J7.25 ; port VID_IN_CSI1_D13
VID_IN_CSI1_D14: J7.26 ; port VID_IN_CSI1_D14
VID_IN_CSI1_D15: J7.27 ; port VID_IN_CSI1_D15
VID_IN_CSI1_D16: J7.29 ; port VID_IN_CSI1_D16
VID_IN_CSI1_D17: J7.30 ; port VID_IN_CSI1_D17
VID_IN_CSI1_D18: J7.31 ; port VID_IN_CSI1_D18
VID_IN_CSI1_D19: J7.32 ; port VID_IN_CSI1_D19
VID_IN_CSI1_DE: J7.34 ; port VID_IN_CSI1_DE
VID_IN_CSI1_HSYNC: J7.6 ; port VID_IN_CSI1_HSYNC
VID_IN_CSI1_INT: J7.35 ; port VID_IN_CSI1_INT
VID_IN_CSI1_INT2: J7.36 ; port VID_IN_CSI1_INT2
VID_IN_CSI1_PIXCLK: R275.1 ; port VID_IN_CSI1_PIXCLK
VID_IN_CSI1_PIXCLK_R: J7.4 R275.2
VID_IN_CSI1_RSTn: J7.37 ; port VID_IN_CSI1_RSTn
VID_IN_CSI1_VSYNC: J7.7 ; port VID_IN_CSI1_VSYNC

### Layout directives
net class DISP1: (no net found under the mark)
net class VID_IN_CSI1: (no net found under the mark), I2C3_CSI1_SCL, I2C3_CSI1_SDA, VID_IN_CSI1_PIXCLK_R
differential pair; net class DIFF100: CSI_CLK0_R_N, CSI_CLK0_R_P, CSI_D0_R_N, CSI_D0_R_P, CSI_D1_R_N, CSI_D1_R_P, LVDS0_CLK_R_N, LVDS0_CLK_R_P
net class TS: TS_X+, TS_X-, TS_Y+, TS_Y-
net class CSI / LVDS: CSI_CLK0_R_N, CSI_CLK0_R_P, CSI_D0_R_N, CSI_D0_R_P, CSI_D1_R_N, CSI_D1_R_P, I2C2_CSI_SCL, I2C2_CSI_SDA, LVDS0_CLK_R_N, LVDS0_CLK_R_P

### Notes on the sheet
- LVDS / CSI, LCD / CSI1 CONNECTORS, TOUSCHSCREEN
- CSI / LVDS Routing
- CSI1 / DISP1 Connector
- VID_IN_CSI1_HSYNC
- VID_IN_CSI1_VSYNC
- VID_IN_CSI1_PIXCLK
- DISP1_PIXCLK
- DISP1_HSYNC
- DISP1_VSYNC
- *0
- VID_IN_CSI1_D0
- VID_IN_CSI1_D1
- VID_IN_CSI1_D2
- VID_IN_CSI1_D3
- DISP1_D0
- DISP1_D1
- DISP1_D2
- DISP1_D3
- DESIGN NOTE:
  Fit only one resistor per one signal according to the picture below.
- VID_IN_CSI1_D4
- VID_IN_CSI1_D5
- VID_IN_CSI1_D6
- VID_IN_CSI1_D7
- DISP1_D4
- DISP1_D5
- DISP1_D6
- DISP1_D7
- CPU CSI
- CON
- CPU LVDS
- VID_IN_CSI1_D8
- VID_IN_CSI1_D9
- VID_IN_CSI1_D10
- VID_IN_CSI1_D11
- DISP1_D8
- DISP1_D9
- DISP1_D10
- DISP1_D11
- *1
- LVDS to CON
- 0R
- VID_IN_CSI1_D12
- VID_IN_CSI1_D13
- VID_IN_CSI1_D14
- VID_IN_CSI1_D15
- DISP1_D12
- DISP1_D13
- DISP1_D14
- DISP1_D15
- CSI to CON
- VID_IN_CSI1_D16
- VID_IN_CSI1_D17
- VID_IN_CSI1_D18
- VID_IN_CSI1_D19
- DISP1_D16
- DISP1_D17
- DISP1_D18
- DISP1_D19
- VID_IN_CSI1_RSTn
- VID_IN_CSI1_INT
- VID_IN_CSI1_DE
- VID_IN_CSI1_INT2
- DISP1_RSTn
- DISP1_RDX
- DISP1_WRX
- DISP1_CS0
- DESIGN NOTE:
  Be aware, after reset some CSI1 / DISP1 pins are set as output. Be sure before you enable a camera, these pins should be set correctly as inputs otherwise there may be a conflict between camera and CPU pins.
  Default state of CSI1/DISP1 signal after reset:
  *0 - Ouptut Low
  *1 - Output High
- DESIGN NOTE:
  Contacts are located on the top side of the pins of FFC connector.
- CSI Camera / LVDS Connector
- Touchscreen Connector
- (Raspberry Pi compatible)
- LVDS0_TX0_R_N
- LVDS0_TX1_R_N
- LVDS0_TX0_R_P
- LVDS0_TX1_R_P
- CSI_GPIO1_R
- CSI_GPIO0_R
- LVDS0_TX2_R_P
- LVDS0_TX2_R_N
- DESIGN NOTE:
  Before you plug in cable into connector J12, be sure, that the correct interface is selected with the optional series resistors.
- LVDS0_DPS
- LVDS0_FRC
- DESIGN NOTE:
  CSI connector is pin compatable with Raspbery Pi camera connector.
- DESIGN NOTE:
  Touchscreen is connected to MCU LPC13xx. These signals can be configured also as Analog inputs, GPIO or PWM outputs.
- FREE for personal and commercial use. See the license.
- DESIGN NOTE:
  FRC - number of colors used:
  High: 16,777,216 colors
  Low or Open: 262,144 colors
- DESIGN NOTE:
  DPS -  scan direction:
  High: Reverse scan
  Low or Open: Normal scan
- DESIGN NOTE:
  If FRC & DPS are used (for some LVDS displays), do not fit R154 & R156 and choose the proper combination of resistors R52, R53, R54 & R191.
- Variant:
- Checked by
- Designed by www.fedevel.com
- (in symbol SDTitleBlock) Title:; Page Contents:; Revision:; Size:; DWG NO; Date:; Sheet; of

### Library data of the parts
C225 C278 = C1608X5R0J106M: CAP CER 10UF 6.3V X5R 20% 0603; Manufacturer: TDK Corporation; Capacitance: 10µF; Value: 10µF; .Checked PCB: used; Category: Capacitors; Supplier Part Number: 445-4112-1-ND; Manufacturer Part Number: C1608X5R0J106M; Operating Temperature: -55°C ~ 85°C; Package / Case: 0603 (1608 Metric); Price 1k [$]: 0.08580; .Checked SCH: used; Voltage - Rated: 6.3V; Features: Low ESR; Supplier: Digikey; Supplier 1: Digi-Key; Supplier Part Number 1: 445-4112-1-ND; RoHS: RoHS Compliant; Stock 1: 48157; Pricing 1: 1=0.46, 10=0.363, 100=0.1898, 250=0.14024, 500=0.1089, 1000=0.0858 (USD); Tolerance: ±20%; Temperature Coefficient: X5R; Mounting Type: Surface Mount, MLCC; Applications: General Purpose; Ratings: -; Size / Dimension: 0.063" L x 0.031" W (1.60mm x 0.80mm); Height - Seated (Max): -; Thickness (Max): 0.037" (0.95mm); Lead Spacing: -; Packaging: Cut Tape (CT); Lead Style: -; ComponentLink1URL: http://www.tdk.com/pdf/general_B11.pdf; ComponentLink1Description: http://www.tdk.com/pdf/general_B11.pdf
C226 C279 = C1005X5R1H104K: CAP CER .10UF 50V X5R 10% 0402; Manufacturer: TDK Corporation; Capacitance: 0.1µF; Value: 100nF; .Checked PCB: used; Category: Capacitors; Supplier Part Number: 445-5942-1-ND; Manufacturer Part Number: C1005X5R1H104K; Operating Temperature: -55°C ~ 85°C; Package / Case: 0402 (1005 Metric); Price 1k [$]: 0.02340; .Checked SCH: used; Voltage - Rated: 50V; Supplier: Digikey; Supplier 1: Digi-Key; Supplier Part Number 1: 445-5942-1-ND; RoHS: RoHS Compliant; Stock 1: 106926; Pricing 1: 1=0.27, 10=0.18, 100=0.072, 250=0.05176, 500=0.0369, 1000=0.027 (USD); Tolerance: ±10%; Temperature Coefficient: X5R; Mounting Type: Surface Mount, MLCC; Applications: General Purpose; Ratings: -; Size / Dimension: 0.039" L x 0.020" W (1.00mm x 0.50mm); Height - Seated (Max): -; Thickness (Max): 0.022" (0.55mm); Lead Spacing: -; Features: -; Packaging: Cut Tape (CT); Lead Style: -; ComponentLink1URL: http://www.tdk.co.jp/tefe02/e412_c.pdf; ComponentLink1Description: http://www.tdk.co.jp/tefe02/e412_c.pdf
D37 = BZA956A,115: TVS ZENER QUAD 5.6V SOT665; Manufacturer: NXP Semiconductors; Voltage - Reverse Standoff (Typ): 3V; Voltage - Breakdown: 5.32V; Power (Watts): 16W; Polarization: 4 Channel Array - Unidirectional; .Creator: MM; .Checked PCB: used; Supplier 1: Digi-Key; Manufacturer Part Number: BZA956A,115; RoHS: RoHS Compliant; Category: Circuit Protection; Stock 1: 7740; Pricing 1: 1=0.55, 10=0.386, 25=0.3176, 100=0.2537, 250=0.1848, 500=0.15008, 1000=0.11536 (USD); Packaging: Cut Tape (CT); Mounting Type: Surface Mount; Package / Case: SOT-665; Supplier Device Package: SOT-665; ComponentLink1URL: http://www.nxp.com/documents/data_sheet/BZA900A_SERIES.pdf; ComponentLink1Description: http://www.nxp.com/documents/data_sheet/BZA900A_SERIES.pdf; Supplier Part Number 1: 568-7016-1-ND; .Checked SCH: used
FB14 FB16 = BLM18SG221TN1D: FERRITE CHIP 220 OHM 2500MA 0603; Manufacturer: Murata Electronics North America; Impedance @ Frequency: 220 Ohm @ 100MHz; DC Resistance (DCR): 40 mOhm Max; Filter Type: Differential Mode - Single; Number of Lines: 1; .Checked PCB: used; Supplier 1: Digi-Key; Supplier Part Number 1: 490-5225-1-ND; Manufacturer Part Number: BLM18SG221TN1D; RoHS: RoHS Compliant; Category: Filters; Stock 1: 54640; Pricing 1: 1=0.38, 10=0.282, 50=0.1646, 100=0.1316, 250=0.094, 500=0.06392, 1000=0.0517, 5000=0.04042 (USD); Current Rating: 2.5A; Package / Case: 0603 (1608 Metric); Mounting Type: Surface Mount; Packaging: Cut Tape (CT); Height (Max): 0.037" (0.95mm); Size / Dimension: 0.063" L x 0.031" W (1.60mm x 0.80mm); ComponentLink1URL: http://search.murata.co.jp/Ceramy/image/img/PDF/ENG/L0110S0100BLM18S.pdf; ComponentLink1Description: http://search.murata.co.jp/Ceramy/image/img/PDF/ENG/L0110S0100BLM18S.pdf; .Checked SCH: used
J7 = 4-1734592-0: CONN FPC BOTTOM 40POS 0.50MM R/A; Manufacturer: TE Connectivity; Connector/Contact Type: Contacts, Bottom; Number of Positions: 40; Pitch: 0.020" (0.50mm); FFC, FCB Thickness: 0.30mm; Locking Feature: Slide Lock; Cable End Type: Tapered; Actuator Material: Thermoplastic; Voltage Rating: 250V; Material Flammability Rating: UL94 V-0; Current Rating: 0.5A; .Creator: MM; Supplier 1: Digi-Key; Manufacturer Part Number: 4-1734592-0; RoHS: RoHS Compliant; Category: Connectors, Interconnects; Stock 1: 8552; Pricing 1: 1=1.31, 10=1.154, 25=1.0864, 50=1.0412, 100=0.9959, 250=0.90536, 500=0.81482, 1000=0.72429 (USD); Packaging: Cut Tape (CT); Flat Flex Type: FPC; Mounting Type: Surface Mount, Right Angle; Termination: Solder; Height Above Board: 0.081" (2.05mm); Contact Material: Phosphor Bronze; Contact Finish: Gold; Housing Material: Liquid Crystal Polymer (LCP); Features: Solder Retention, Zero Insertion Force (ZIF); Operating Temperature: -40°C ~ 85°C; ComponentLink1URL: http://www.te.com/commerce/DocumentDelivery/DDEController?Action=srchrtrv&DocNm=1734592&DocType=Customer+Drawing&DocLang=English; ComponentLink1Description: http://www.te.com/commerce/DocumentDelivery/DDEController?Action=srchrtrv&DocNm=1734592&DocType=Customer+Drawing&DocLang=English; Supplier Part Number 1: A100226CT-ND; .Checked PCB: MM; .Checked SCH: MM
J10 = 0532610471: CONN HEADER 4POS 1.25MM R/A SMD; Manufacturer: Molex Inc; Connector Type: Header, Shrouded; Number of Positions: 4; Number of Positions Loaded: All; Pitch: 0.049" (1.25mm); .Creator: MM; .Checked PCB: used; Supplier 1: Digi-Key; Manufacturer Part Number: 0532610471; RoHS: RoHS Compliant; Category: Connectors, Interconnects; Stock 1: 9616; Pricing 1: 1=1.5, 10=1.318, 25=1.2404, 50=1.1888, 100=1.1372, 250=1.0338, 500=0.9304 (USD); Packaging: Cut Tape (CT); Contact Type: Blade Pin; Number of Rows: 1; Row Spacing: -; Contact Mating Length: -; Mounting Type: Surface Mount, Right Angle; Termination: Solder; Fastening Type: -; Features: Solder Retention; Contact Finish: Tin; Contact Finish Thickness: 39µin (1.00µm); Color: Natural; ComponentLink1URL: http://www.molex.com/pdm_docs/sd/532610471_sd.pdf; ComponentLink1Description: http://www.molex.com/pdm_docs/sd/532610471_sd.pdf; Supplier Part Number 1: WM7622CT-ND; .Checked SCH: used
J12 = 1-84952-5: CONN FPC BOTTOM 15POS 1.00MM R/A; Manufacturer: TE Connectivity; Connector/Contact Type: Contacts, Bottom; Number of Positions: 15; Pitch: 0.039" (1.00mm); FFC, FCB Thickness: 0.30mm; Locking Feature: Slide Lock; Cable End Type: Straight; Actuator Material: Polyamide (PA), Nylon, Glass Filled; Voltage Rating: 200V; Material Flammability Rating: UL94 V-0; Current Rating: 1A; .Creator: MM; Supplier 1: Digi-Key; Manufacturer Part Number: 1-84952-5; RoHS: RoHS Compliant; Category: Connectors, Interconnects; Stock 1: 3321; Pricing 1: 1=2.32, 10=2.107, 25=1.9776, 50=1.8918, 100=1.8057, 250=1.63376, 500=1.50478 (USD); Packaging: Cut Tape (CT); Flat Flex Type: FPC; Mounting Type: Surface Mount, Right Angle; Termination: Solder; Height Above Board: 0.101" (2.56mm); Contact Material: Phosphor Bronze; Contact Finish: Tin; Housing Material: Liquid Crystal Polymer (LCP), Glass Filled; Features: Solder Retention, Zero Insertion Force (ZIF); Operating Temperature: -40°C ~ 85°C; ComponentLink1URL: http://www.te.com/commerce/DocumentDelivery/DDEController?Action=srchrtrv&DocNm=84952&DocType=Customer+Drawing&DocLang=English; ComponentLink1Description: http://www.te.com/commerce/DocumentDelivery/DDEController?Action=srchrtrv&DocNm=84952&DocType=Customer+Drawing&DocLang=English; Supplier Part Number 1: A101391CT-ND; .Checked PCB: MM; .Checked SCH: MM
R33 R65 R71 R119-R123 R125-R129 R135 R136 R138 R154 R156 R195 R196 = RC0402JR-070RL: RES 0.0 OHM 1/16W 0402 SMD; Manufacturer: Yageo; Resistance (Ohms): 0.0; Power (Watts): 0.063W, 1/16W; Tolerance: Jumper; .Checked PCB: used; Category: Resistors; Manufacturer Part Number: RC0402JR-070RL; Package / Case: 0402 (1005 Metric); Price 1k [$]: 0.01389; Value: 0R; .Checked SCH: used; Supplier Part Number: 311-0.0JRCT-ND; Supplier: Digikey; Supplier 1: Digi-Key; Supplier Part Number 1: 311-0.0JRCT-ND; RoHS: RoHS Compliant; Stock 1: 1106330; Pricing 1: 10=0.012, 50=0.009, 100=0.0069, 250=0.00512, 500=0.0038, 1000=0.00253 (USD); Composition: Thick Film; Features: -; Temperature Coefficient: -; Size / Dimension: 0.039" L x 0.020" W (1.00mm x 0.50mm); Height: 0.016" (0.40mm); Number of Terminations: 2; Packaging: Cut Tape (CT); ComponentLink1URL: http://www.yageo.com/documents/recent/PYu-RC0402_51_RoHS_L_6.pdf; ComponentLink1Description: http://www.yageo.com/documents/recent/PYu-RC0402_51_RoHS_L_6.pdf
R52-R54 R191 = RC0402FR-0710KL: RES 10.0K OHM 1/16W 1% 0402 SMD; Manufacturer: Yageo; Power (Watts): 0.063W, 1/16W; .Checked PCB: used; Temperature Coefficient: ±100ppm/°C; Category: Resistors; Supplier Part Number: 311-10.0KLRCT-ND; Manufacturer Part Number: RC0402FR-0710KL; Package / Case: 0402 (1005 Metric); Price 1k [$]: 0.01421; Resistance (Ohms): 10K; Tolerance: ±1%; Value: 10k; .Checked SCH: used; Supplier: Digikey; Supplier 1: Digi-Key; Supplier Part Number 1: 311-10.0KLRCT-ND; RoHS: RoHS Compliant; Stock 1: 2916495; Pricing 1: 10=0.014, 50=0.0104, 100=0.0079, 250=0.00584, 500=0.00432, 1000=0.00288 (USD); Composition: Thick Film; Features: -; Size / Dimension: 0.039" L x 0.020" W (1.00mm x 0.50mm); Height: 0.016" (0.40mm); Number of Terminations: 2; Packaging: Cut Tape (CT); ComponentLink1URL: http://www.yageo.com/documents/recent/PYu-RC0402_51_RoHS_L_6.pdf; ComponentLink1Description: http://www.yageo.com/documents/recent/PYu-RC0402_51_RoHS_L_6.pdf
R275 = RC0402FR-0722RL: RES 22.0 OHM 1/16W 1% 0402 SMD; Manufacturer: Yageo; Resistance (Ohms): 22; Power (Watts): 0.063W, 1/16W; .Checked PCB: used; Temperature Coefficient: ±100ppm/°C; Category: Resistors; Supplier Part Number: 311-22.0LRCT-ND; Manufacturer Part Number: RC0402FR-0722RL; Package / Case: 0402 (1005 Metric); Price 1k [$]: 0.01421; Tolerance: ±1%; Value: 22R; .Checked SCH: used; Supplier: Digikey; Supplier 1: Digi-Key; Supplier Part Number 1: 311-22.0LRCT-ND; RoHS: RoHS Compliant; Stock 1: 943800; Pricing 1: 10=0.014, 50=0.0104, 100=0.0079, 250=0.00584, 500=0.00432, 1000=0.00288 (USD); Composition: Thick Film; Features: -; Size / Dimension: 0.039" L x 0.020" W (1.00mm x 0.50mm); Height: 0.016" (0.40mm); Number of Terminations: 2; Packaging: Cut Tape (CT); ComponentLink1URL: http://www.yageo.com/documents/recent/PYu-RC0402_51_RoHS_L_6.pdf; ComponentLink1Description: http://www.yageo.com/documents/recent/PYu-RC0402_51_RoHS_L_6.pdf
TP19 TP20 = TP_25MILC: Test Point 25mil

## Sheet [04] - CPU - PCIE, USB.SchDoc
size A2; DocumentNumber: 4; SheetNumber: 4; SheetTotal: 31
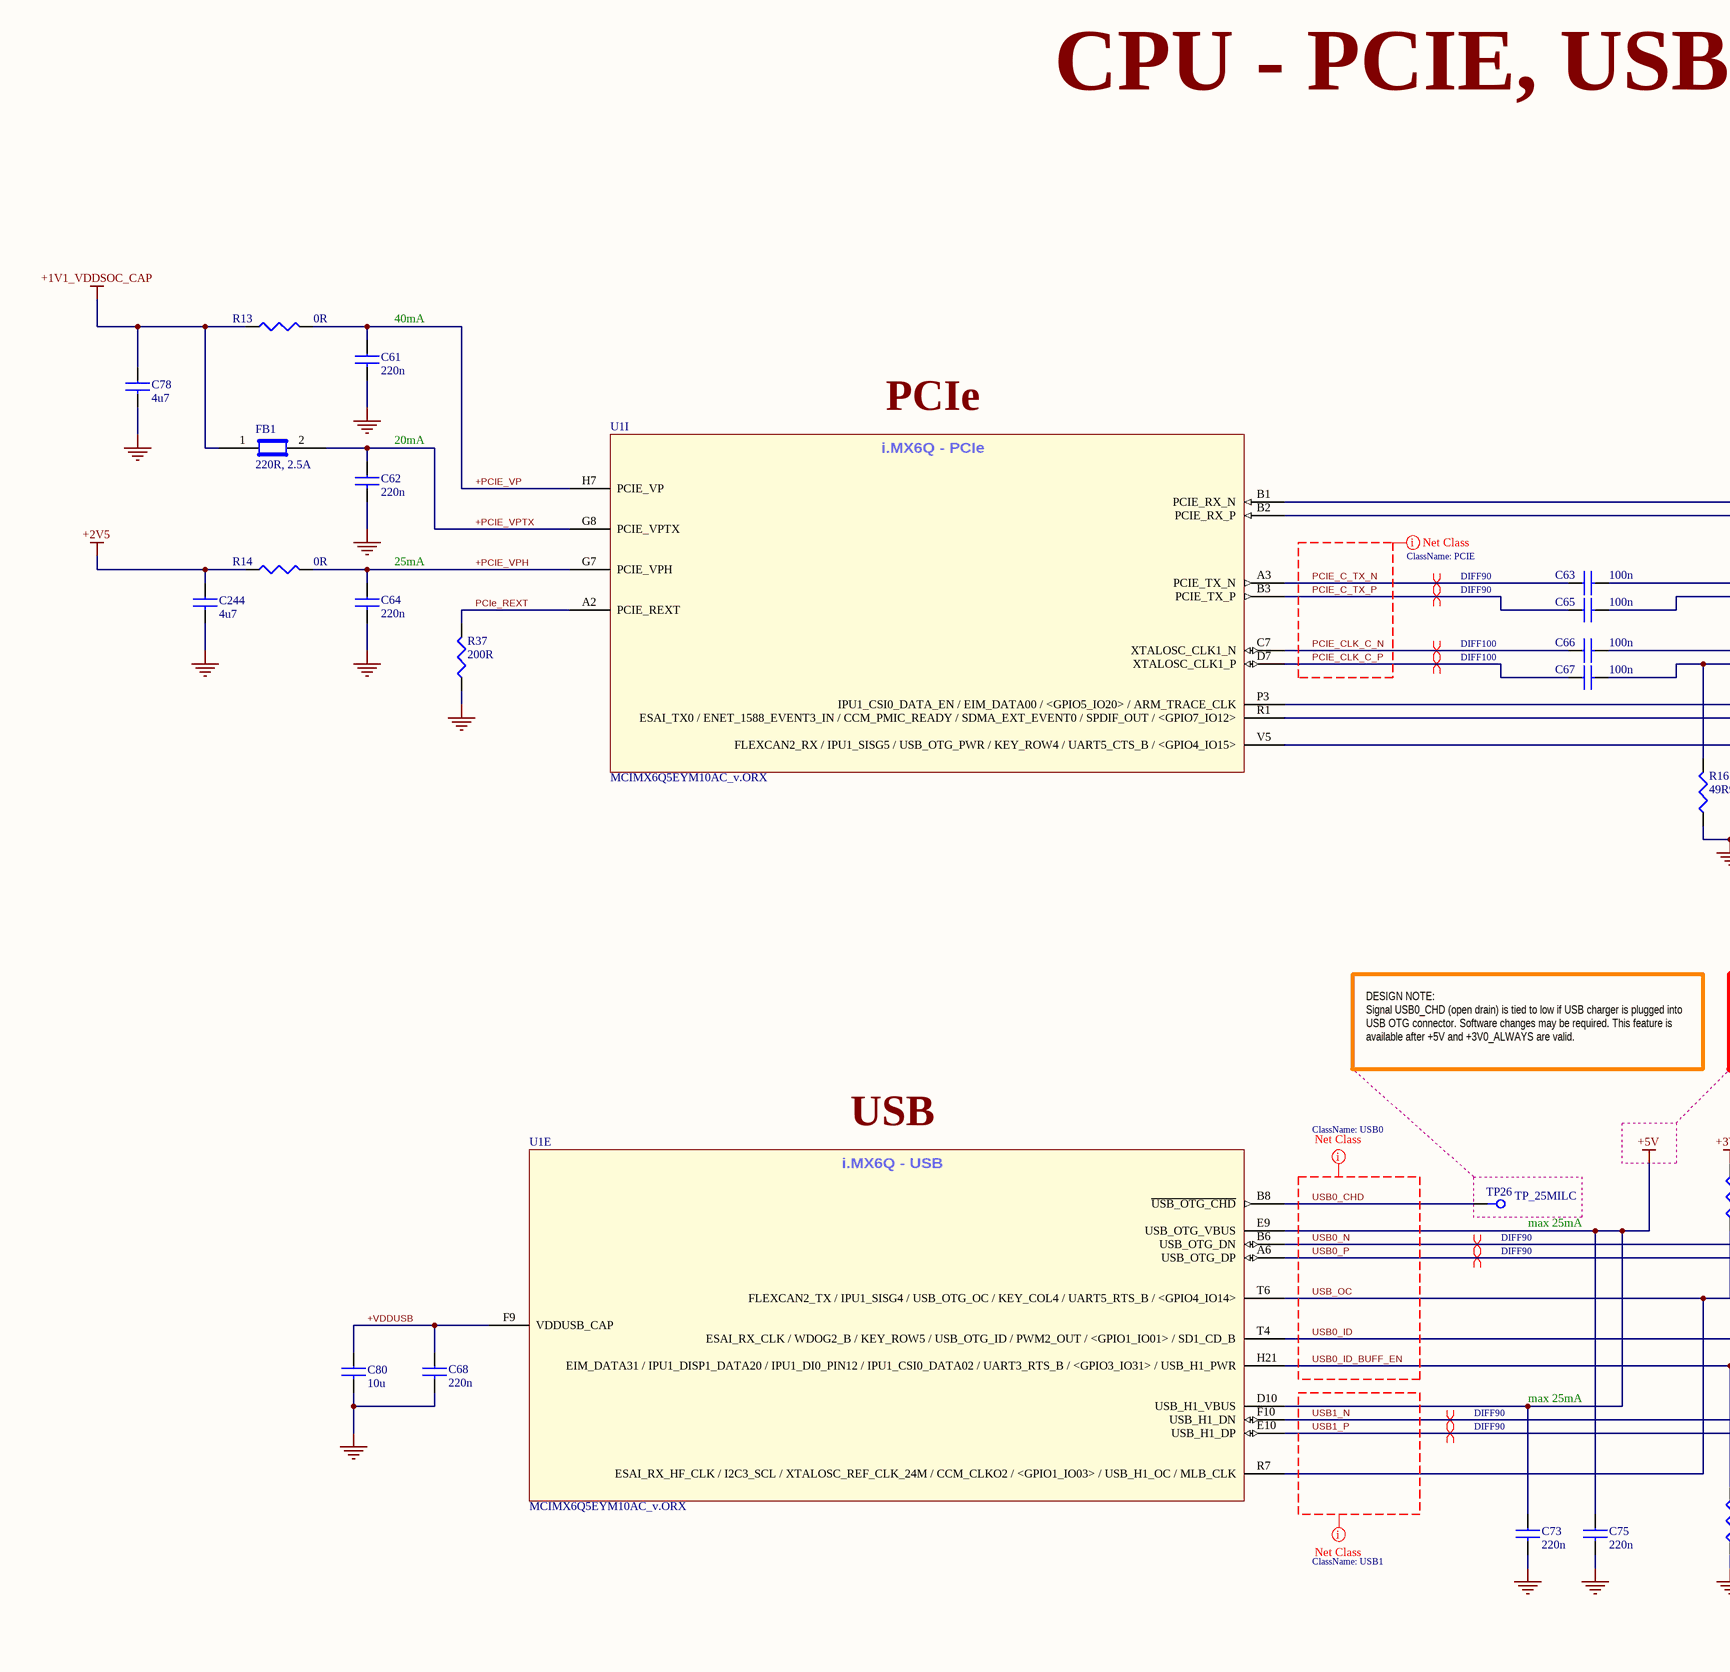
[diagram p6: [04] - CPU - PCIE, USB.SchDoc, left]
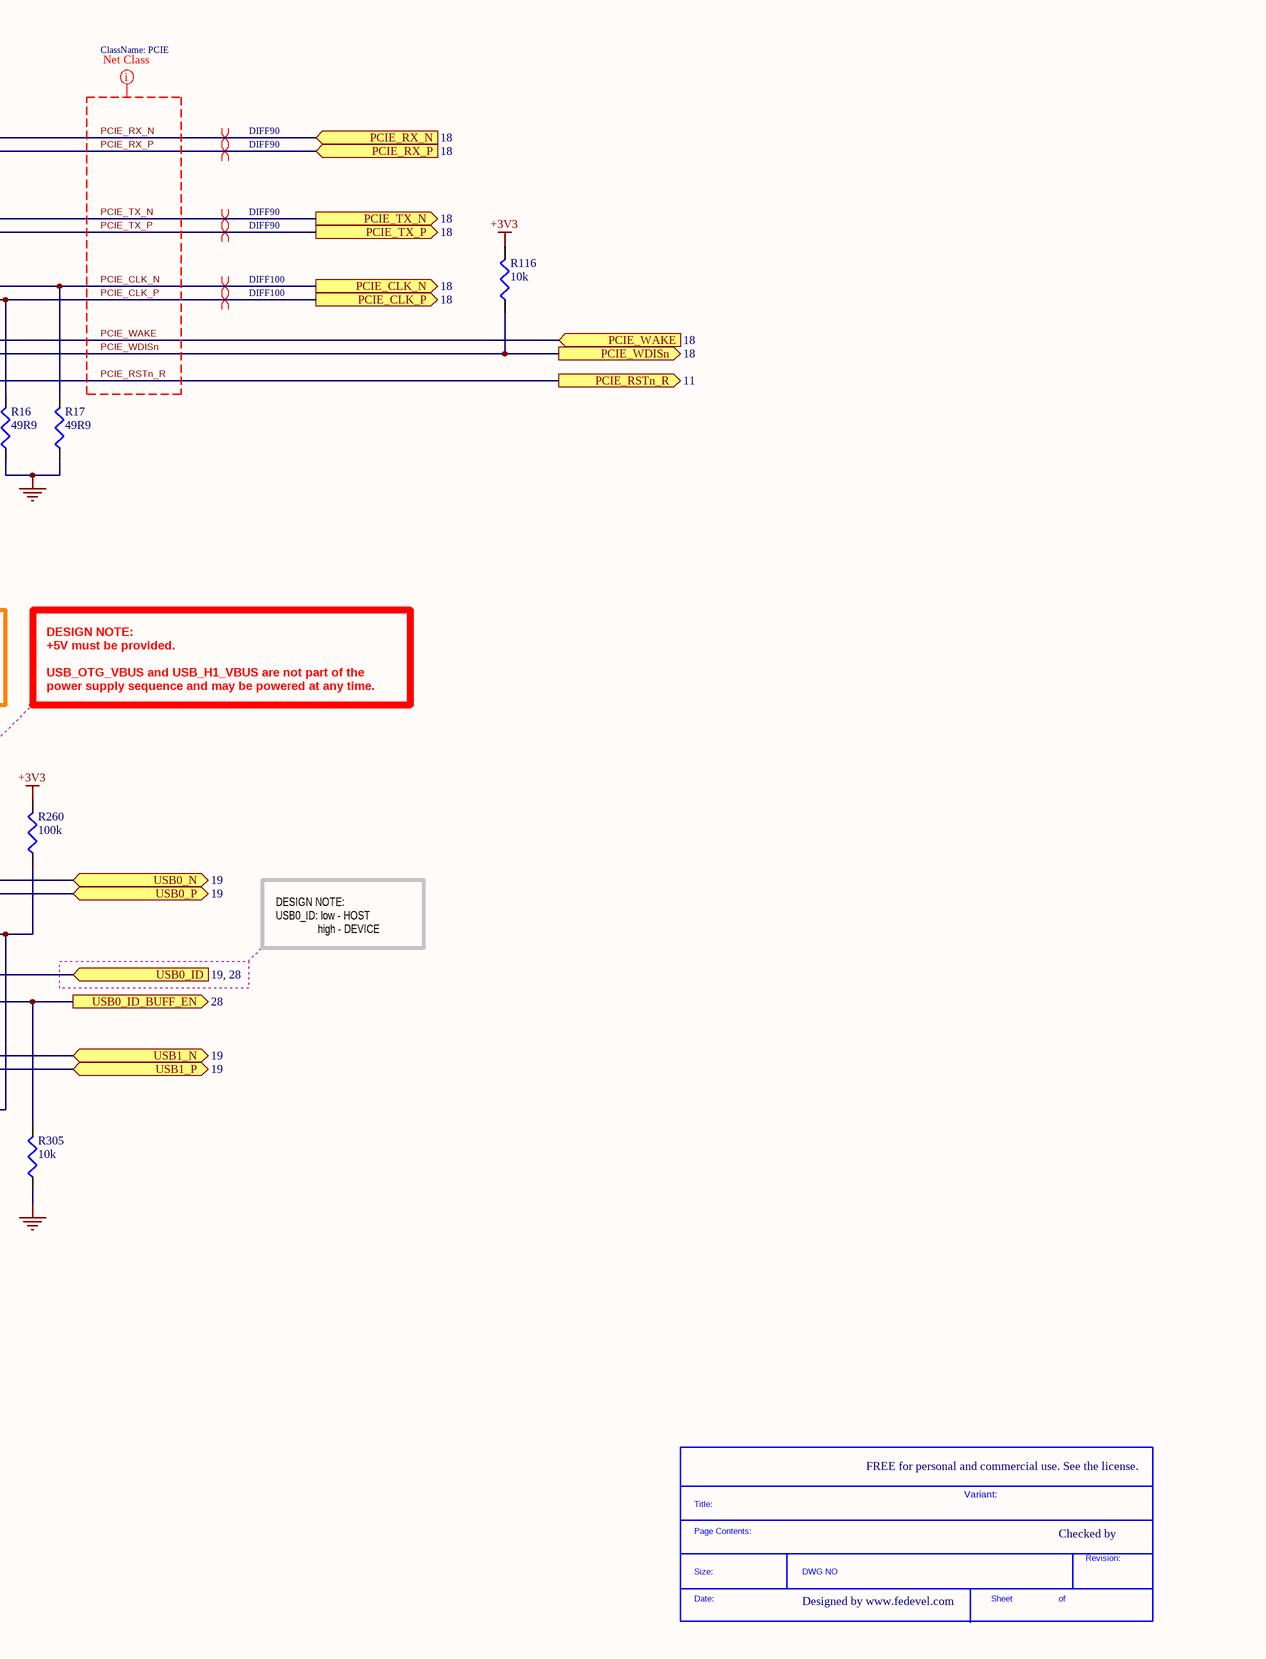
[diagram p7: [04] - CPU - PCIE, USB.SchDoc, right]

### Parts
(Parts that share a designator on the sheet are numbered #1, #2 ... from top to bottom, then left to right.)
*#5  SDTitleBlock  (value not drawn)  (graphical)
C61  220n  [C0201]
C62  220n  [C0201]
C63  100n  [C0402]
C64  220n  [C0201]
C65  100n  [C0402]
C66  100n  [C0402]
C67  100n  [C0402]
C68  220n  [C0201]
C73  220n  [C0201]
C75  220n  [C0201]
C78  4u7  [C0402]
C80  10u  [C0603]
C244  4u7  [C0402]
FB1  220R, 2.5A  [C0603]
R13  0R  [R0402]
R14  0R  [R0402]
R16  49R9  [R0402]
R17  49R9  [R0402]
R37  200R  [R0402]
R116  10k  [R0402]
R260  100k  [R0201]
R305  10k  [R0402]
TP26  TP_25MILC  [TP_25C]  (no BOM)
U1  MCIMX6Q5EYM10AC_v.ORX  [PBGA624]  (parts E,I of 21)

### Ports
PCIE_CLK_N (out, see 18), PCIE_CLK_P (out, see 18), PCIE_RSTn_R (out, see 11), PCIE_RX_N (in, see 18), PCIE_RX_P (in, see 18), PCIE_TX_N (out, see 18), PCIE_TX_P (out, see 18), PCIE_WAKE (in, see 18), PCIE_WDISn (out, see 18), USB0_ID (see 19, 28), USB0_ID_BUFF_EN (out, see 28), USB0_N (bidir, see 19), USB0_P (bidir, see 19), USB1_N (bidir, see 19), USB1_P (bidir, see 19)

### Nets
+1V1_VDDSOC_CAP: C78.1 FB1.1 R13.1
+2V5: C244.1 R14.1
+3V3: R116.2 R260.2
+5V: C73.1 C75.1 U1.D10(USB_H1_VBUS) U1.E9(USB_OTG_VBUS)
GND: C61.2 C62.2 C64.2 C68.2 C73.2 C75.2 C78.2 C80.2 C244.2 R16.1 R17.1 R37.1 R305.1
+PCIE_VP: C61.1 R13.2 U1.H7(PCIE_VP)
+PCIE_VPH: C64.1 R14.2 U1.G7(PCIE_VPH)
+PCIE_VPTX: C62.1 FB1.2 U1.G8(PCIE_VPTX)
+VDDUSB: C68.1 C80.1 U1.F9(VDDUSB_CAP)
PCIE_C_TX_N: C63.1 U1.A3(PCIE_TX_N)
PCIE_C_TX_P: C65.1 U1.B3(PCIE_TX_P)
PCIE_CLK_C_N: C66.1 U1.C7(XTALOSC_CLK1_N)
PCIE_CLK_C_P: C67.1 U1.D7(XTALOSC_CLK1_P)
PCIE_CLK_N: C66.2 R17.2 ; port PCIE_CLK_N
PCIE_CLK_P: C67.2 R16.2 ; port PCIE_CLK_P
PCIe_REXT: R37.2 U1.A2(PCIE_REXT)
PCIE_RSTn_R: U1.V5(FLEXCAN2_RX_/_IPU1_SISG5_/_USB_OTG_PWR_/_KEY_ROW4_/_UART5_CTS_B_/_<GPIO4_IO15>) ; port PCIE_RSTn_R
PCIE_RX_N: U1.B1(PCIE_RX_N) ; port PCIE_RX_N
PCIE_RX_P: U1.B2(PCIE_RX_P) ; port PCIE_RX_P
PCIE_TX_N: C63.2 ; port PCIE_TX_N
PCIE_TX_P: C65.2 ; port PCIE_TX_P
PCIE_WAKE: U1.P3(IPU1_CSI0_DATA_EN_/_EIM_DATA00_/_<GPIO5_IO20>_/_ARM_TRACE_CLK) ; port PCIE_WAKE
PCIE_WDISn: R116.1 U1.R1(ESAI_TX0_/_ENET_1588_EVENT3_IN_/_CCM_PMIC_READY_/_SDMA_EXT_EVENT0_/_SPDIF_OUT_/_<GPIO7_IO12>) ; port PCIE_WDISn
USB0_CHD: TP26.1 U1.B8(~{USB_OTG_CHD})
USB0_ID: U1.T4(ESAI_RX_CLK_/_WDOG2_B_/_KEY_ROW5_/_USB_OTG_ID_/_PWM2_OUT_/_<GPIO1_IO01>_/_SD1_CD_B) ; port USB0_ID
USB0_ID_BUFF_EN: R305.2 U1.H21(EIM_DATA31_/_IPU1_DISP1_DATA20_/_IPU1_DI0_PIN12_/_IPU1_CSI0_DATA02_/_UART3_RTS_B_/_<GPIO3_IO31>_/_USB_H1_PWR) ; port USB0_ID_BUFF_EN
USB0_N: U1.B6(USB_OTG_DN) ; port USB0_N
USB0_P: U1.A6(USB_OTG_DP) ; port USB0_P
USB1_N: U1.F10(USB_H1_DN) ; port USB1_N
USB1_P: U1.E10(USB_H1_DP) ; port USB1_P
USB_OC: R260.1 U1.R7(ESAI_RX_HF_CLK_/_I2C3_SCL_/_XTALOSC_REF_CLK_24M_/_CCM_CLKO2_/_<GPIO1_IO03>_/_USB_H1_OC_/_MLB_CLK) U1.T6(FLEXCAN2_TX_/_IPU1_SISG4_/_USB_OTG_OC_/_KEY_COL4_/_UART5_RTS_B_/_<GPIO4_IO14>)

### Layout directives
differential pair; net class DIFF100: PCIE_CLK_C_N, PCIE_CLK_C_P, PCIE_CLK_N, PCIE_CLK_P
differential pair; net class DIFF90: PCIE_C_TX_N, PCIE_C_TX_P, PCIE_RX_N, PCIE_RX_P, PCIE_TX_N, PCIE_TX_P, USB0_N, USB0_P, USB1_N, USB1_P
net class PCIE: PCIE_C_TX_N, PCIE_C_TX_P, PCIE_CLK_C_N, PCIE_CLK_C_P, PCIE_CLK_N, PCIE_CLK_P, PCIE_RSTn_R, PCIE_RX_N, PCIE_RX_P, PCIE_TX_N, PCIE_TX_P, PCIE_WAKE, PCIE_WDISn
net class USB0: USB0_CHD, USB0_ID, USB0_ID_BUFF_EN, USB0_N, USB0_P, USB_OC
net class USB1: USB1_N, USB1_P

### Notes on the sheet
- CPU - PCIE, USB
- (near C61) 40mA
- PCIe
- (near C62) 20mA
- (near C64) 25mA
- DESIGN NOTE:
  Signal USB0_CHD (open drain) is tied to low if USB charger is plugged into USB OTG connector. Software changes may be required. This feature is available after +5V and +3V0_ALWAYS are valid.
- DESIGN NOTE:
  +5V must be provided.
  USB_OTG_VBUS and USB_H1_VBUS are not part of the power supply sequence and may be powered at any time.
- USB
- (near TP26) max 25mA
- DESIGN NOTE:
  USB0_ID: low - HOST
  high - DEVICE
- max 25mA
- FREE for personal and commercial use. See the license.
- Variant:
- Checked by
- Designed by www.fedevel.com
- (in symbol MCIMX6Q5EYM10AC_v.ORX, part E) i.MX6Q - USB
- (in symbol MCIMX6Q5EYM10AC_v.ORX, part I) i.MX6Q - PCIe
- (in symbol SDTitleBlock) Title:; Page Contents:; Revision:; Size:; DWG NO; Date:; Sheet; of

### Library data of the parts
C61 C62 C64 C68 C73 C75 = C0603X5R0J224M030BB: CAP CER 0.22UF 6.3V 20% X5R 0201; Manufacturer: TDK Corporation; Capacitance: 0.22µF; .Checked PCB: MM; Supplier 1: Digi-Key; Manufacturer Part Number: C0603X5R0J224M030BB; RoHS: RoHS Compliant; Category: Capacitors; Stock 1: 205900; Pricing 1: 1=0.15, 10=0.102, 100=0.0485, 250=0.0408, 500=0.03418, 1000=0.0275, 5000=0.02325 (USD); Packaging: Cut Tape (CT); Tolerance: ±20%; Voltage - Rated: 6.3V; Temperature Coefficient: X5R; Mounting Type: Surface Mount, MLCC; Operating Temperature: -55°C ~ 85°C; Applications: General Purpose; Ratings: -; Package / Case: 0201 (0603 Metric); Size / Dimension: 0.024" L x 0.012" W (0.60mm x 0.30mm); Height - Seated (Max): -; Thickness (Max): 0.013" (0.33mm); Lead Spacing: -; Features: -; Lead Style: -; ComponentLink1URL: http://product.tdk.com/en/catalog/datasheets/mlcc_commercial_general_en.pdf; ComponentLink1Description: http://product.tdk.com/en/catalog/datasheets/mlcc_commercial_general_en.pdf; Supplier Part Number 1: 445-5929-1-ND; .Checked SCH: MM; .Creator: MM
C63 C65-C67 = C1005X5R1H104K: as C226 on sheet [17] - LVDS, CSI, LCD, TSC; Category: Capacitors; Supplier Part Number: 445-5942-1-ND; Manufacturer Part Number: C1005X5R1H104K; Operating Temperature: -55°C ~ 85°C; Package / Case: 0402 (1005 Metric); Price 1k [$]: 0.02340; .Checked SCH: used; Voltage - Rated: 50V; Supplier: Digikey; Supplier 1: Digi-Key; Supplier Part Number 1: 445-5942-1-ND; RoHS: RoHS Compliant; Stock 1: 106926; Pricing 1: 1=0.27, 10=0.18, 100=0.072, 250=0.05176, 500=0.0369, 1000=0.027 (USD); Tolerance: ±10%; Temperature Coefficient: X5R; Mounting Type: Surface Mount, MLCC; Applications: General Purpose; Ratings: -; Size / Dimension: 0.039" L x 0.020" W (1.00mm x 0.50mm); Height - Seated (Max): -; Thickness (Max): 0.022" (0.55mm); Lead Spacing: -; Features: -; Packaging: Cut Tape (CT); Lead Style: -; ComponentLink1URL: http://www.tdk.co.jp/tefe02/e412_c.pdf; ComponentLink1Description: http://www.tdk.co.jp/tefe02/e412_c.pdf
C78 C244 = C1005X5R1A475M: CAP CER 4.7UF 10V 20% X5R 0402; Manufacturer: TDK Corporation; Capacitance: 4.7µF; .Checked PCB: used; Supplier 1: Digi-Key; Supplier Part Number 1: 445-8023-1-ND; Manufacturer Part Number: C1005X5R1A475M; RoHS: RoHS Compliant; Category: Capacitors; Stock 1: 10140; Pricing 1: 1=0.53, 10=0.415, 100=0.25, 250=0.18752, 500=0.16, 1000=0.125, 5000=0.095 (USD); Voltage - Rated: 10V; Tolerance: ±20%; Temperature Coefficient: X5R; Mounting Type: Surface Mount, MLCC; Operating Temperature: -55°C ~ 85°C; Applications: General Purpose; Ratings: -; Package / Case: 0402 (1005 Metric); Size / Dimension: 0.039" L x 0.020" W (1.00mm x 0.50mm); Height - Seated (Max): -; Thickness (Max): -; Lead Spacing: -; Features: -; Packaging: Cut Tape (CT); Lead Style: -; ComponentLink1URL: http://www.tdk.com/pdf/general_B11.pdf; ComponentLink1Description: http://www.tdk.com/pdf/general_B11.pdf; .Checked SCH: used
C80 = C1608X5R0J106M: as C225 on sheet [17] - LVDS, CSI, LCD, TSC; Category: Capacitors; Supplier Part Number: 445-4112-1-ND; Manufacturer Part Number: C1608X5R0J106M; Operating Temperature: -55°C ~ 85°C; Package / Case: 0603 (1608 Metric); Price 1k [$]: 0.08580; .Checked SCH: used; Voltage - Rated: 6.3V; Features: Low ESR; Supplier: Digikey; Supplier 1: Digi-Key; Supplier Part Number 1: 445-4112-1-ND; RoHS: RoHS Compliant; Stock 1: 48157; Pricing 1: 1=0.46, 10=0.363, 100=0.1898, 250=0.14024, 500=0.1089, 1000=0.0858 (USD); Tolerance: ±20%; Temperature Coefficient: X5R; Mounting Type: Surface Mount, MLCC; Applications: General Purpose; Ratings: -; Size / Dimension: 0.063" L x 0.031" W (1.60mm x 0.80mm); Height - Seated (Max): -; Thickness (Max): 0.037" (0.95mm); Lead Spacing: -; Packaging: Cut Tape (CT); Lead Style: -; ComponentLink1URL: http://www.tdk.com/pdf/general_B11.pdf; ComponentLink1Description: http://www.tdk.com/pdf/general_B11.pdf
FB1 = BLM18SG221TN1D: as FB14 on sheet [17] - LVDS, CSI, LCD, TSC; Supplier 1: Digi-Key; Supplier Part Number 1: 490-5225-1-ND; Manufacturer Part Number: BLM18SG221TN1D; RoHS: RoHS Compliant; Category: Filters; Stock 1: 54640; Pricing 1: 1=0.38, 10=0.282, 50=0.1646, 100=0.1316, 250=0.094, 500=0.06392, 1000=0.0517, 5000=0.04042 (USD); Current Rating: 2.5A; Package / Case: 0603 (1608 Metric); Mounting Type: Surface Mount; Packaging: Cut Tape (CT); Height (Max): 0.037" (0.95mm); Size / Dimension: 0.063" L x 0.031" W (1.60mm x 0.80mm); ComponentLink1URL: http://search.murata.co.jp/Ceramy/image/img/PDF/ENG/L0110S0100BLM18S.pdf; ComponentLink1Description: http://search.murata.co.jp/Ceramy/image/img/PDF/ENG/L0110S0100BLM18S.pdf; .Checked SCH: used
R13 R14 = RC0402JR-070RL: as R33 on sheet [17] - LVDS, CSI, LCD, TSC; Category: Resistors; Supplier Part Number: 311-0.0JRCT-ND; Manufacturer Part Number: RC0402JR-070RL; Package / Case: 0402 (1005 Metric); Price 1k [$]: 0.01389; Value: 0R; .Checked SCH: used; Supplier: Digikey; Supplier 1: Digi-Key; Supplier Part Number 1: 311-0.0JRCT-ND; RoHS: RoHS Compliant; Stock 1: 1106330; Pricing 1: 10=0.012, 50=0.009, 100=0.0069, 250=0.00512, 500=0.0038, 1000=0.00253 (USD); Composition: Thick Film; Features: -; Temperature Coefficient: -; Size / Dimension: 0.039" L x 0.020" W (1.00mm x 0.50mm); Height: 0.016" (0.40mm); Number of Terminations: 2; Packaging: Cut Tape (CT); ComponentLink1URL: http://www.yageo.com/documents/recent/PYu-RC0402_51_RoHS_L_6.pdf; ComponentLink1Description: http://www.yageo.com/documents/recent/PYu-RC0402_51_RoHS_L_6.pdf
R16 R17 = RC0402FR-0749R9L: RES 49.9 OHM 1/16W 1% 0402 SMD; Manufacturer: Yageo; Resistance (Ohms): 49.9; Power (Watts): 0.063W, 1/16W; Value: 49.9R; .Checked PCB: used; Temperature Coefficient: ±100ppm/°C; Category: Resistors; Supplier Part Number: 311-49.9LRCT-ND; Manufacturer Part Number: RC0402FR-0749R9L; Package / Case: 0402 (1005 Metric); Price 1k [$]: 0.01421; Tolerance: ±1%; .Checked SCH: used; Supplier: Digikey; Supplier 1: Digi-Key; Supplier Part Number 1: 311-49.9LRCT-ND; RoHS: RoHS Compliant; Stock 1: 235950; Pricing 1: 10=0.014, 50=0.0104, 100=0.0079, 250=0.00584, 500=0.00432, 1000=0.00288 (USD); Composition: Thick Film; Features: -; Size / Dimension: 0.039" L x 0.020" W (1.00mm x 0.50mm); Height: 0.016" (0.40mm); Number of Terminations: 2; Packaging: Cut Tape (CT); ComponentLink1URL: http://www.yageo.com/documents/recent/PYu-RC0402_51_RoHS_L_6.pdf; ComponentLink1Description: http://www.yageo.com/documents/recent/PYu-RC0402_51_RoHS_L_6.pdf
R37 = CRCW0402200RFKED: RES 200 OHM 1/16W 1% 0402 SMD; Manufacturer: Vishay Dale; Resistance (Ohms): 200; Power (Watts): 0.063W, 1/16W; Temperature Coefficient: ±100ppm/°C; .Checked PCB: used; .Creator: MM; Supplier 1: Digi-Key; Manufacturer Part Number: CRCW0402200RFKED; RoHS: RoHS Compliant; Category: Resistors; Stock 1: 251574; Pricing 1: 10=0.083, 50=0.0444, 200=0.0255, 1000=0.0174 (USD); Composition: Thick Film; Features: Automotive AEC-Q200 Qualified; Tolerance: ±1%; Package / Case: 0402 (1005 Metric); Supplier Device Package: 0402 (1005 Metric); Size / Dimension: 0.039" L x 0.020" W (1.00mm x 0.50mm); Height: 0.016" (0.40mm); Number of Terminations: 2; Packaging: Cut Tape (CT); ComponentLink1URL: http://www.vishay.com/doc?20035; ComponentLink1Description: http://www.vishay.com/doc?20035; Supplier Part Number 1: 541-200LCT-ND; .Checked SCH: used
R116 R305 = RC0402FR-0710KL: as R52 on sheet [17] - LVDS, CSI, LCD, TSC; Category: Resistors; Supplier Part Number: 311-10.0KLRCT-ND; Manufacturer Part Number: RC0402FR-0710KL; Package / Case: 0402 (1005 Metric); Price 1k [$]: 0.01421; Resistance (Ohms): 10K; Tolerance: ±1%; Value: 10k; .Checked SCH: used; Supplier: Digikey; Supplier 1: Digi-Key; Supplier Part Number 1: 311-10.0KLRCT-ND; RoHS: RoHS Compliant; Stock 1: 2916495; Pricing 1: 10=0.014, 50=0.0104, 100=0.0079, 250=0.00584, 500=0.00432, 1000=0.00288 (USD); Composition: Thick Film; Features: -; Size / Dimension: 0.039" L x 0.020" W (1.00mm x 0.50mm); Height: 0.016" (0.40mm); Number of Terminations: 2; Packaging: Cut Tape (CT); ComponentLink1URL: http://www.yageo.com/documents/recent/PYu-RC0402_51_RoHS_L_6.pdf; ComponentLink1Description: http://www.yageo.com/documents/recent/PYu-RC0402_51_RoHS_L_6.pdf
R260 = RC0201FR-07100KL: RES 100K OHM 1/20W 1% 0201 SMD; Manufacturer: Yageo; Power (Watts): 0.05W, 1/20W; Temperature Coefficient: ±200ppm/°C; .Creator: MM; Supplier 1: Digi-Key; Manufacturer Part Number: RC0201FR-07100KL; RoHS: RoHS Compliant; Category: Resistors; Stock 1: 0; Pricing 1: 1=0.1, 10=0.074, 25=0.054, 100=0.0303, 250=0.02312, 500=0.0185, 1000=0.01361, 2500=0.01182, 5000=0.00976 (USD); Packaging: Cut Tape (CT); Resistance (Ohms): 100k; Tolerance: ±1%; Composition: Thick Film; Features: Moisture Resistant; Package / Case: 0201 (0603 Metric); Supplier Device Package: 0201; Size / Dimension: 0.024" L x 0.012" W (0.60mm x 0.30mm); Height: 0.010" (0.26mm); Number of Terminations: 2; ComponentLink1URL: http://www.yageo.com/documents/recent/PYu-RC0201_51_RoHS_L_8.pdf; ComponentLink1Description: http://www.yageo.com/documents/recent/PYu-RC0201_51_RoHS_L_8.pdf; Supplier Part Number 1: 311-100KMCT-ND; .Checked PCB: MM; .Checked SCH: MM
TP26 = TP_25MILC: Test Point 25mil
U1 = MCIMX6Q5EYM10AC_v.ORX: IC MCU 32BIT ARM QUAD 624FCBGA; Manufacturer: Freescale Semiconductor; Speed: 1.0GHz; .Creator: MM; .Checked PCB: MM, checked by RF; Core Processor: ARM® Cortex™-A9; Core Size: 32-Bit Quad-Core; Connectivity: CAN, EBI/EMI, ESAI, Ethernet, GPMI, I2C, MMC/SD, PCI, SATA, SPI, UART, USB, USB OTG; Peripherals: DMA, HDMI, I2S/SSI/AC97, MIPI CSI, MIMI DSI, MIPI HIS, PWM, WDT; Number of I /O: 224; Program Memory Type: External Program Memory; RAM Size: 256K x 8; Voltage - Supply (Vcc/Vdd): 0.925 V ~ 1.5 V; Oscillator Type: Internal; Supplier 1: Digi-Key; Manufacturer Part Number: MCIMX6Q5EYM10AC; RoHS: RoHS Compliant; Category: Integrated Circuits (ICs); Stock 1: 0; Pricing 1: 1=54.98, 10=51.922, 25=48.868, 100=30.5424 (USD); Packaging: Tray; Package / Case: 624-FBGA, FCBGA; ComponentLink1URL: http://cache.freescale.com/files/32bit/doc/data_sheet/IMX6DQCEC.pdf; ComponentLink1Description: http://cache.freescale.com/files/32bit/doc/data_sheet/IMX6DQCEC.pdf; Supplier Part Number 1: MCIMX6Q5EYM10AC-ND; Program Memory Size: -; EEPROM Size: -; Data Converters: -; Operating Temperature: -20°C ~ 105°C